# EasyEDA Pro project EasyEDAproject_AngstromIO_Mini_Devboard_2026-03-15.epro, board PCB Panel
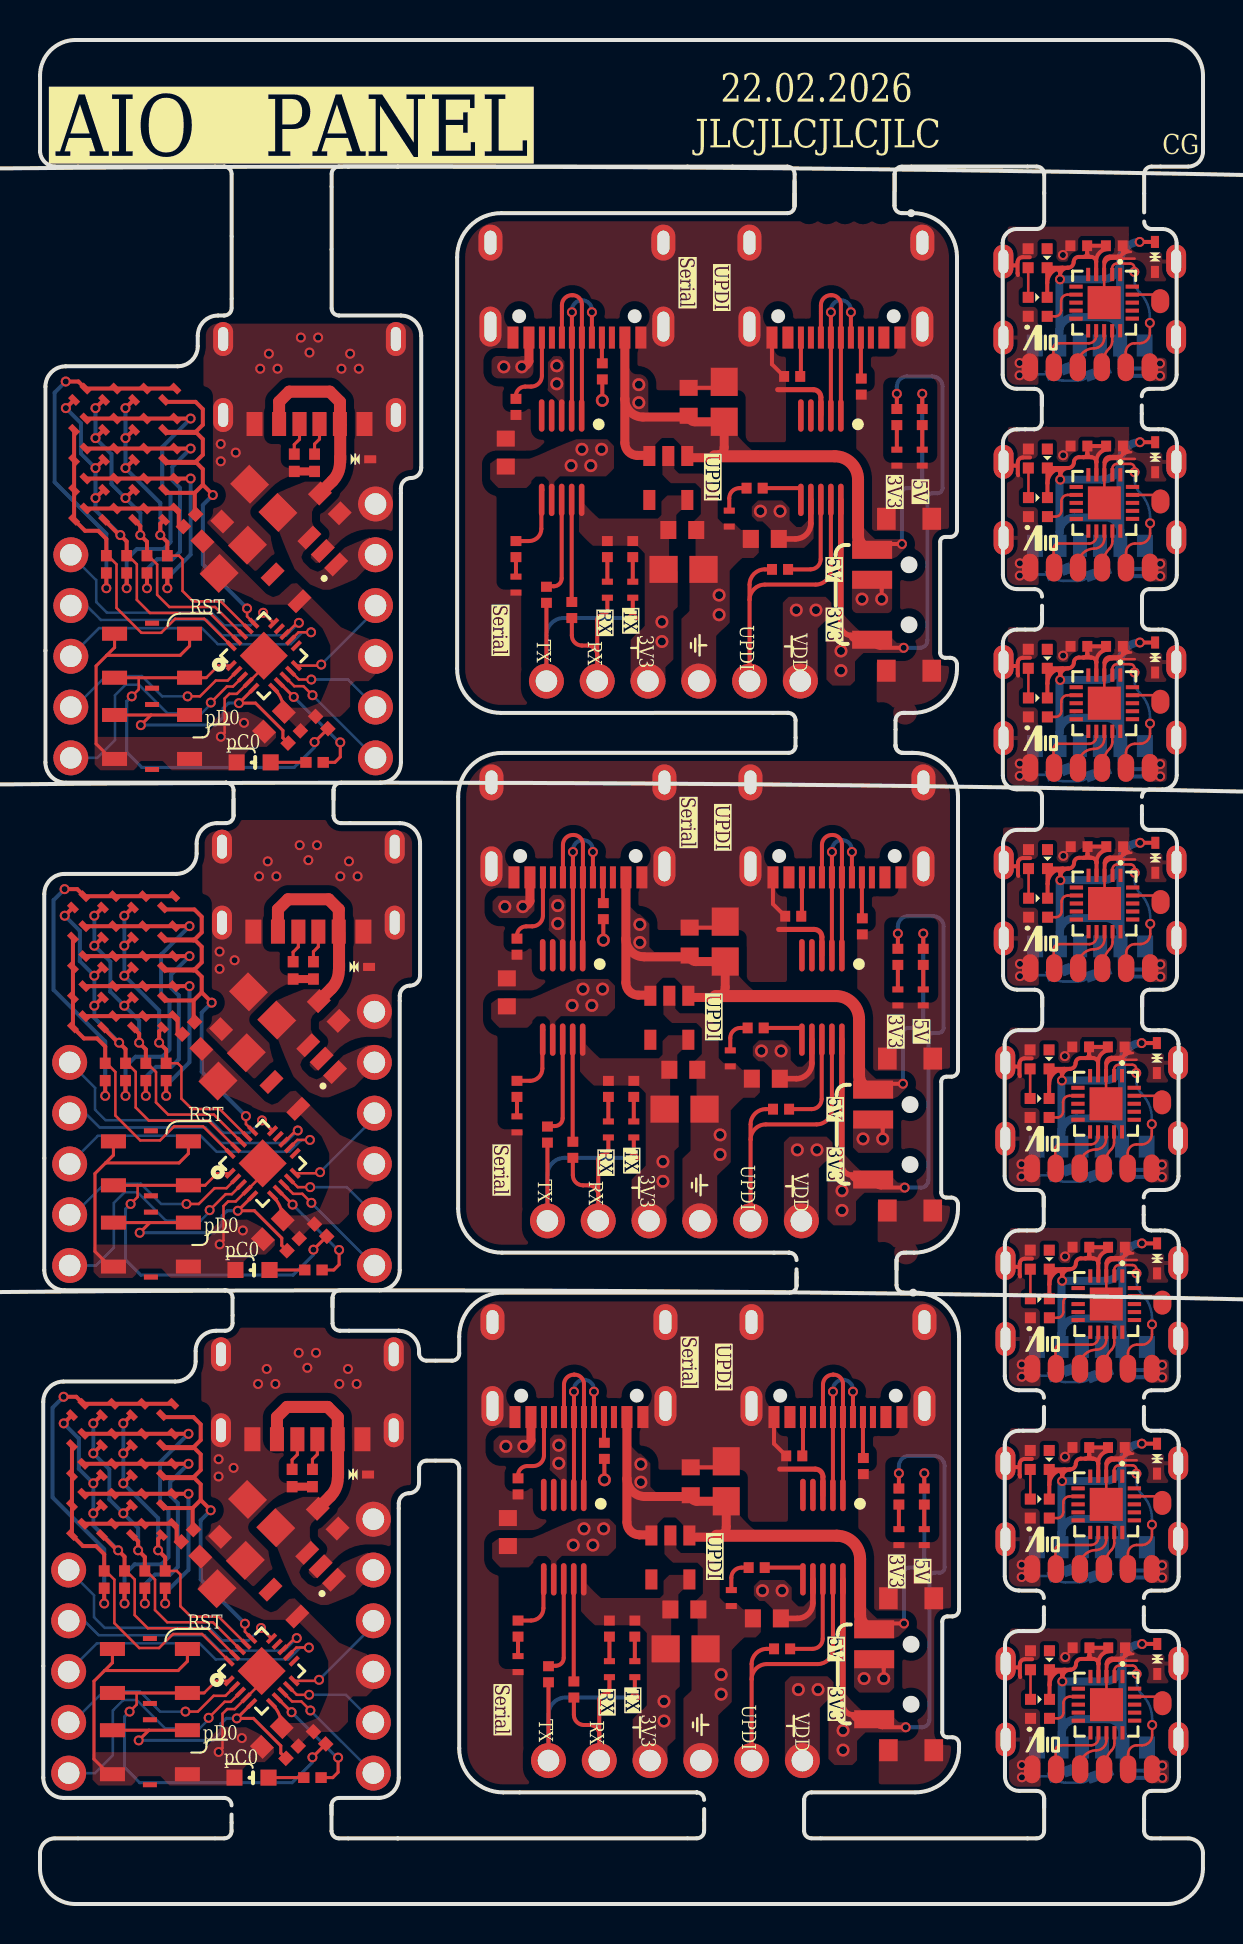
[diagram p1: board, top side]
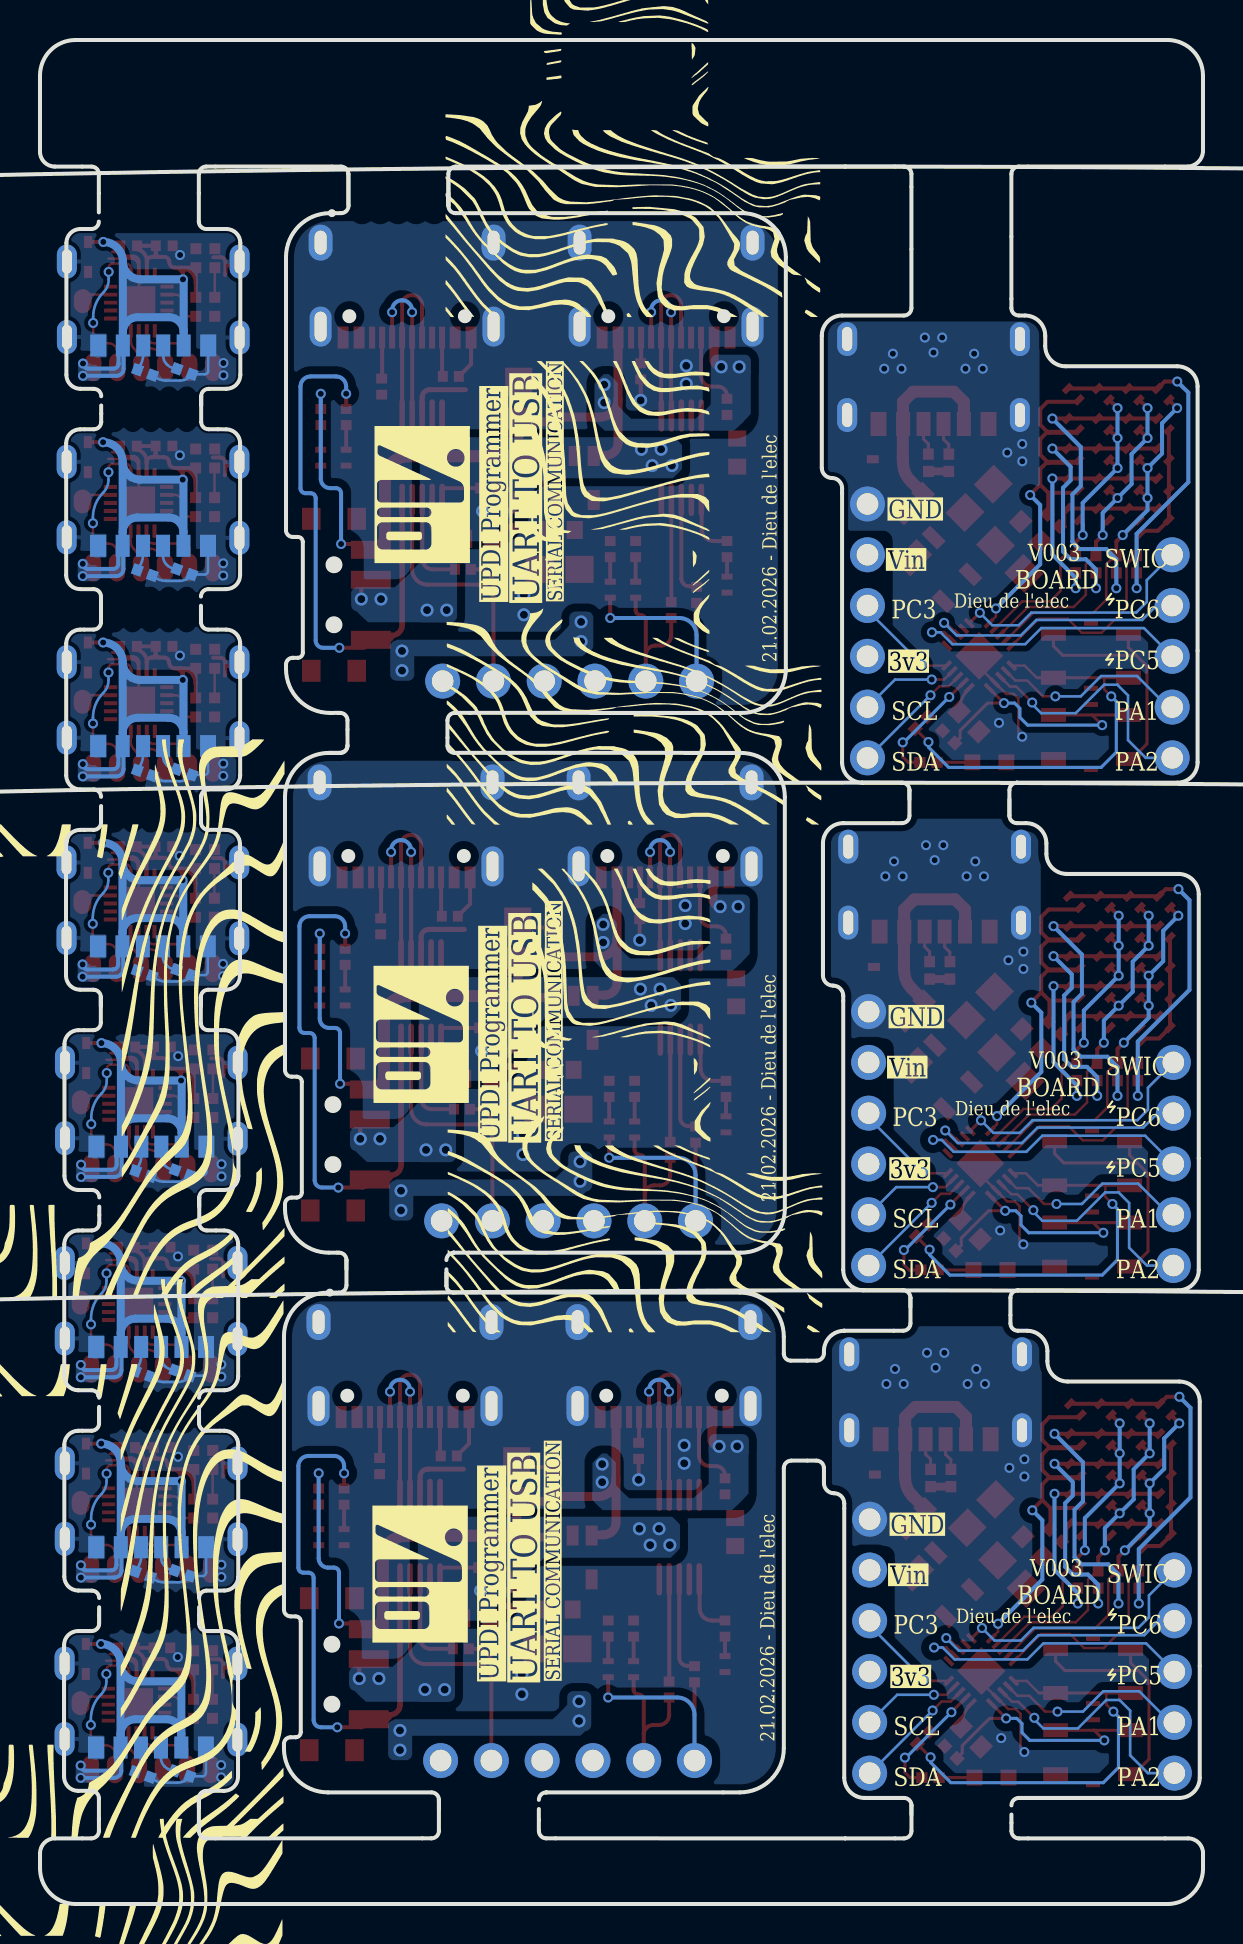
[diagram p2: board, bottom side, seen from below]

Outline 58.17 x 93.24 mm; copper layers: Top Layer, Bottom Layer. Coordinates in mm from the lower left corner of the outline.
Stack: Top Layer 0.035mm / Dielectric1 1.51mm FR4 er 4.5 / Bottom Layer 0.035mm

## Design rules (mm)
template: Custom Config
spacing copperThickness1oz (default): track to track 0.102, other pairs 0.152 to 0.3
spacing copperThickness2oz: track to track 0.203, other pairs 0.152 to 0.3
track width copperThickness1oz (default): min 0.127, default 0.254, max 2.54
track width copperThickness2oz: min 0.203, default 0.254, max 2.54
differential pair differentialPair (default): width min 0.127, default 0.254, max 2.54; gap min 0.152, default 0.152
via viaSize (default): diameter min 0.5, default 0.61, max 10; hole min 0.3, default 0.305, max 6.3
net GND uses PGM gnd
pour e1001 uses copperRegion
pour e456 uses copperRegion1
pour e639 uses copperRegion1
pour e3302 uses copperRegion1
pour e2222 uses cp2
pour e2434 uses copperRegion1
pour e5847 uses copperRegion1
pour e5857 uses copperRegion1
pour e5858 uses copperRegion1
pour e3297 uses copperRegion1
pour e2880 uses copperRegion1
pour e2882 uses copperRegion1
pour e3299 uses copperRegion1
pour e3301 uses copperRegion1
pour e5849 uses copperRegion1
pour e5851 uses copperRegion1
pour e5854 uses copperRegion1
pour e5855 uses copperRegion1

## Placement (name value [footprint] x y rotation side)
C1  100nF  [0603 CAP clean]  11.7 59.14 225 top
C1#2  -  [0603 CAP clean]  11.64 33.75 225 top
C1#3  -  [0603 CAP clean]  11.59 8.35 225 top
C2  10uF  [C0805]  11.19 70.32 135 top
C2#2  -  [C0805]  11.14 44.92 135 top
C2#3  -  [C0805]  11.09 19.53 135 top
C3  100nF  [0603 CAP clean]  14.44 44.67 135 top
C3#2  -  [0603 CAP clean]  14.39 19.28 135 top
C3#3  -  [0603 CAP clean]  14.5 70.06 135 top
C4  100nF  [0603 CAP clean]  8.56 43.27 225 top
C4#2  -  [0603 CAP clean]  8.51 17.88 225 top
C4#3  -  [0603 CAP clean]  8.62 68.66 225 top
C5  10uF  [C0805]  9.61 41.88 45 top
C5#2  -  [C0805]  9.56 16.48 45 top
C5#3  -  [C0805]  9.67 67.27 45 top
C6  10uF  [C0402]  52.06 22.84 0 top
C6#2  -  [C0402]  52.05 42.87 0 top
C6#3  -  [C0402]  52.06 32.85 0 top
C6#4  -  [C0402]  51.95 82.95 0 top
C6#5  -  [C0402]  51.96 62.91 0 top
C6#6  -  [C0402]  51.97 72.93 0 top
C6#7  -  [C0402]  51.97 52.89 0 top
C6#8  -  [C0402]  52.07 12.82 0 top
C7  100nF  [C0402]  53.84 22.84 0 top
C7#2  -  [C0402]  53.83 42.87 0 top
C7#3  -  [C0402]  53.84 32.85 0 top
C7#4  -  [C0402]  53.73 82.95 0 top
C7#5  -  [C0402]  53.74 62.91 0 top
C7#6  -  [C0402]  53.74 72.93 0 top
C7#7  -  [C0402]  53.75 52.89 0 top
C7#8  -  [C0402]  53.85 12.82 0 top
C8  100nF  [0603 CAP clean]  32.23 14.73 180 top
C8#2  -  [0603 CAP clean]  32.13 68.73 180 top
C8#3  -  [0603 CAP clean]  32.18 41.73 180 top
C9  100nF  [0603 CAP clean]  32.55 21.15 270 top
C9#2  -  [0603 CAP clean]  32.44 75.14 270 top
C9#3  -  [0603 CAP clean]  32.49 48.14 270 top
C10  10uF  [C0805]  34.32 21.15 90 top
C10#2  -  [C0805]  34.22 75.14 90 top
C10#3  -  [C0805]  34.27 48.14 90 top
C11  10uF  [C0805]  32.29 12.76 0 top
C11#2  -  [C0805]  32.19 66.76 0 top
C11#3  -  [C0805]  32.24 39.76 0 top
C12  100nF  [0603 CAP clean]  36.36 14.29 0 top
C12#2  -  [0603 CAP clean]  36.25 68.28 0 top
C12#3  -  [0603 CAP clean]  36.3 41.28 0 top
C13  100nF  [0603 CAP clean]  23.4 18.61 270 top
C13#2  -  [0603 CAP clean]  23.3 72.6 270 top
C13#3  -  [0603 CAP clean]  23.35 45.6 270 top
D1  LESD5D5.0CT1G  [SOD-523_L1.2-W0.8-LS1.6-BI]  15.71 46.88 180 top
D1#2  -  [SOD-523_L1.2-W0.8-LS1.6-BI]  15.66 21.48 180 top
D1#3  -  [SOD-523_L1.2-W0.8-LS1.6-BI]  15.77 72.27 180 top
D2  LESD5D5.0CT1G  [SOD-523_L1.2-W0.8-LS1.6-BI]  55.78 52.33 90 top
D2#2  -  [SOD-523_L1.2-W0.8-LS1.6-BI]  55.87 22.28 90 top
D2#3  -  [SOD-523_L1.2-W0.8-LS1.6-BI]  55.86 42.32 90 top
D2#4  -  [SOD-523_L1.2-W0.8-LS1.6-BI]  55.87 32.3 90 top
D2#5  -  [SOD-523_L1.2-W0.8-LS1.6-BI]  55.88 12.26 90 top
D2#6  -  [SOD-523_L1.2-W0.8-LS1.6-BI]  55.76 82.39 90 top
D2#7  -  [SOD-523_L1.2-W0.8-LS1.6-BI]  55.77 62.35 90 top
D2#8  -  [SOD-523_L1.2-W0.8-LS1.6-BI]  55.78 72.37 90 top
LED1  XL-1608UOC-06  [Dice  0603 LED BLANK]  10.63 31.72 0 top
LED1#2  -  [Dice  0603 LED BLANK]  10.58 6.32 0 top
LED1#3  -  [Dice  0603 LED BLANK]  10.69 57.11 0 top
LED2  XL-1005SURC  [LED0402]  1.93 50.13 45 top
LED2#2  -  [LED0402]  1.88 24.74 45 top
LED2#3  -  [LED0402]  1.99 75.52 45 top
LED3  XL-1005SURC  [LED0402]  3.43 50.13 45 top
LED3#2  -  [LED0402]  3.38 24.74 45 top
LED3#3  -  [LED0402]  3.49 75.52 45 top
LED4  XL-1005SURC  [LED0402]  4.93 50.13 45 top
LED4#2  -  [LED0402]  4.88 24.74 45 top
LED4#3  -  [LED0402]  4.99 75.52 45 top
LED5  XL-1005SURC  [LED0402]  6.49 75.52 45 top
LED5#2  -  [LED0402]  6.43 50.13 45 top
LED5#3  -  [LED0402]  6.38 24.74 45 top
LED6  XL-1005SURC  [LED0402]  1.99 74.02 45 top
LED6#2  -  [LED0402]  1.93 48.63 45 top
LED6#3  -  [LED0402]  1.88 23.24 45 top
LED7  XL-1005SURC  [LED0402]  3.43 48.63 45 top
LED7#2  -  [LED0402]  3.49 74.02 45 top
LED7#3  -  [LED0402]  3.38 23.24 45 top
LED8  XL-1005SURC  [LED0402]  4.93 48.63 45 top
LED8#2  -  [LED0402]  4.99 74.02 45 top
LED8#3  -  [LED0402]  4.88 23.24 45 top
LED9  XL-1005SURC  [LED0402]  6.43 48.63 45 top
LED9#2  -  [LED0402]  6.49 74.02 45 top
LED9#3  -  [LED0402]  6.38 23.24 45 top
LED10  XL-1005SURC  [LED0402]  1.93 47.13 45 top
LED10#2  -  [LED0402]  1.99 72.52 45 top
LED10#3  -  [LED0402]  1.88 21.74 45 top
LED11  XL-1005SURC  [LED0402]  3.43 47.13 45 top
LED11#2  -  [LED0402]  3.49 72.52 45 top
LED11#3  -  [LED0402]  3.38 21.74 45 top
LED12  XL-1005SURC  [LED0402]  4.93 47.13 45 top
LED12#2  -  [LED0402]  4.99 72.52 45 top
LED12#3  -  [LED0402]  4.88 21.74 45 top
LED13  XL-1005SURC  [LED0402]  6.43 47.13 45 top
LED13#2  -  [LED0402]  6.49 72.52 45 top
LED13#3  -  [LED0402]  6.38 21.74 45 top
LED14  XL-1005SURC  [LED0402]  1.93 45.63 45 top
LED14#2  -  [LED0402]  1.99 71.02 45 top
LED14#3  -  [LED0402]  1.88 20.24 45 top
LED15  XL-1005SURC  [LED0402]  3.43 45.63 45 top
LED15#2  -  [LED0402]  3.38 20.24 45 top
LED15#3  -  [LED0402]  3.49 71.02 45 top
LED16  XL-1005SURC  [LED0402]  4.93 45.63 45 top
LED16#2  -  [LED0402]  4.88 20.24 45 top
LED16#3  -  [LED0402]  4.99 71.02 45 top
LED17  XL-1005SURC  [LED0402]  6.43 45.63 45 top
LED17#2  -  [LED0402]  6.38 20.24 45 top
LED17#3  -  [LED0402]  6.49 71.02 45 top
LED18  XL-1005SURC  [LED0402]  1.93 44.13 45 top
LED18#2  -  [LED0402]  1.88 18.74 45 top
LED18#3  -  [LED0402]  1.99 69.52 45 top
LED19  XL-1005SURC  [LED0402]  3.43 44.13 45 top
LED19#2  -  [LED0402]  3.38 18.74 45 top
LED19#3  -  [LED0402]  3.49 69.52 45 top
LED20  XL-1005SURC  [LED0402]  4.93 44.13 45 top
LED20#2  -  [LED0402]  4.88 18.74 45 top
LED20#3  -  [LED0402]  4.99 69.52 45 top
LED21  XL-1005SURC  [LED0402]  6.43 44.13 45 top
LED21#2  -  [LED0402]  6.38 18.74 45 top
LED21#3  -  [LED0402]  6.49 69.52 45 top
LED22  SK6805-EC15  [LED-SMD_4P-L1.5-W1.5-BL]  50.01 19.78 90 top
LED22#2  -  [LED-SMD_4P-L1.5-W1.5-BL]  50.01 29.8 90 top
LED22#3  -  [LED-SMD_4P-L1.5-W1.5-BL]  50 39.82 90 top
LED22#4  -  [LED-SMD_4P-L1.5-W1.5-BL]  50.02 9.76 90 top
LED22#5  -  [LED-SMD_4P-L1.5-W1.5-BL]  49.9 79.89 90 top
LED22#6  -  [LED-SMD_4P-L1.5-W1.5-BL]  49.91 59.86 90 top
LED22#7  -  [LED-SMD_4P-L1.5-W1.5-BL]  49.91 69.88 90 top
LED22#8  -  [LED-SMD_4P-L1.5-W1.5-BL]  49.92 49.84 90 top
LED23  SK6805-EC15  [LED-SMD_4P-L1.5-W1.5-BL]  50 22.21 0 top
LED23#2  -  [LED-SMD_4P-L1.5-W1.5-BL]  49.99 42.25 0 top
LED23#3  -  [LED-SMD_4P-L1.5-W1.5-BL]  50 32.23 0 top
LED23#4  -  [LED-SMD_4P-L1.5-W1.5-BL]  50.01 12.19 0 top
LED23#5  -  [LED-SMD_4P-L1.5-W1.5-BL]  49.9 82.33 0 top
LED23#6  -  [LED-SMD_4P-L1.5-W1.5-BL]  49.91 62.29 0 top
LED23#7  -  [LED-SMD_4P-L1.5-W1.5-BL]  49.91 72.31 0 top
LED23#8  -  [LED-SMD_4P-L1.5-W1.5-BL]  49.92 52.27 0 top
LED24  XL-1005SURC  [LED0402]  44.18 45.35 90 top
LED24#2  -  [LED0402]  44.23 18.35 90 top
LED24#3  -  [LED0402]  44.13 72.35 90 top
LED25  XL-1005SURC  [LED0402]  42.91 45.35 90 top
LED25#2  -  [LED0402]  42.96 18.35 90 top
LED25#3  -  [LED0402]  42.86 72.35 90 top
LED26  XL-1005SURC  [LED0402]  34.52 42.3 90 top
LED26#2  -  [LED0402]  34.58 15.3 90 top
LED26#3  -  [LED0402]  34.47 69.3 90 top
LED28  XL-1005SURC  [LED0402]  23.86 39 90 top
LED28#2  -  [LED0402]  23.91 12 90 top
LED28#3  -  [LED0402]  23.81 66 90 top
LED29  XL-1005SURC  [LED0402]  28.43 38.74 90 top
LED29#2  -  [LED0402]  28.48 11.75 90 top
LED29#3  -  [LED0402]  28.38 65.74 90 top
LED30  XL-1005SURC  [LED0402]  29.7 38.74 90 top
LED30#2  -  [LED0402]  29.75 11.75 90 top
LED30#3  -  [LED0402]  29.65 65.74 90 top
NOREF  -  [Pad_e5785]  50.73 46.81 0 top
NOREF#2  -  [Pad_e5810]  50.72 66.85 0 top
NOREF#3  -  [Pad_e5805]  54.31 76.87 0 top
NOREF#4  -  [Pad_e3261]  50.81 26.78 0 top
NOREF#5  -  [Pad_e5809]  50.71 76.87 0 top
NOREF#6  -  [Pad_e2863]  54.41 16.76 0 top
NOREF#7  -  [Pad_e2861]  52.01 16.76 0 top
NOREF#8  -  [Pad_e1895]  1.43 6.55 0 top
NOREF#9  -  [Pad_e5792]  55.52 56.83 0 top
NOREF#10  -  [Pad_e1148]  16.72 44.64 0 top
NOREF#11  -  [Pad_e2260]  38.13 7.18 270 top
NOREF#12  -  [Pad_e5807]  51.91 76.87 0 top
NOREF#13  -  [Pad_e51]  1.54 67.49 0 top
NOREF#14  -  [Pad_e127]  16.78 70.03 0 top
NOREF#15  -  [Pad_e85]  53.22 6.74 0 top
NOREF#16  -  [Pad_e223]  38.08 34.17 270 top
NOREF#17  -  [Pad_e3378]  30.41 61.17 270 top
NOREF#18  -  [Pad_e1136]  1.48 39.56 0 top
NOREF#19  -  [Pad_e221]  33 34.17 270 top
NOREF#20  -  [Pad_e95]  54.42 6.74 0 top
NOREF#21  -  [Pad_e3263]  53.21 26.78 0 top
NOREF#22  -  [Pad_e75]  49.62 6.74 0 top
NOREF#23  -  [Pad_e5797]  51.92 66.85 0 top
NOREF#24  -  [Pad_e3268]  50.8 36.8 0 top
NOREF#25  -  [Pad_e3259]  56.14 30.08 0 top
NOREF#26  -  [Pad_e2862]  53.21 16.76 0 top
NOREF#27  -  [Pad_e5791]  56.05 50.12 0 top
NOREF#28  -  [Pad_e3265]  55.61 26.78 0 top
NOREF#29  -  [Pad_e1893]  1.43 14.17 0 top
NOREF#30  -  [Pad_e1898]  16.67 6.55 0 top
NOREF#31  -  [Pad_e2864]  55.61 16.76 0 top
NOREF#32  -  [Pad_e72]  55.62 6.74 0 top
NOREF#33  -  [Pad_e3379]  32.95 61.17 270 top
NOREF#34  -  [Pad_e90]  16.78 59.87 0 top
NOREF#35  -  [Pad_e2258]  25.43 7.18 270 top
NOREF#36  -  [Pad_e54]  1.54 64.95 0 top
NOREF#37  -  [Pad_e1142]  1.48 34.48 0 top
NOREF#38  -  [Pad_e2262]  33.05 7.18 270 top
NOREF#39  -  [Pad_e2860]  50.81 16.76 0 top
NOREF#40  -  [Pad_e1902]  16.67 16.71 0 top
NOREF#41  -  [Pad_e226]  27.92 34.17 270 top
NOREF#42  -  [Pad_e220]  30.46 34.17 270 top
NOREF#43  -  [Pad_e1137]  1.48 37.02 0 top
NOREF#44  -  [Pad_e102]  16.78 64.95 0 top
NOREF#45  -  [Pad_e5789]  51.93 46.81 0 top
NOREF#46  -  [Pad_e1146]  16.72 39.56 0 top
NOREF#47  -  [Pad_e1135]  1.48 42.1 0 top
NOREF#48  -  [Pad_e222]  35.54 34.17 270 top
NOREF#49  -  [Pad_e1894]  1.43 11.63 0 top
NOREF#50  -  [Pad_e5799]  49.52 66.85 0 top
NOREF#51  -  [Pad_e5806]  54.32 66.85 0 top
NOREF#52  -  [Pad_e2858]  56.13 20.06 0 top
NOREF#53  -  [Pad_e3271]  54.4 36.8 0 top
NOREF#54  -  [Pad_e3270]  53.2 36.8 0 top
NOREF#55  -  [Pad_e1901]  16.67 14.17 0 top
NOREF#56  -  [Pad_e55]  1.54 62.41 0 top
NOREF#57  -  [Pad_e59]  1.54 59.87 0 top
NOREF#58  -  [Pad_e2261]  35.59 7.18 270 top
NOREF#59  -  [Pad_e1138]  1.48 31.94 0 top
NOREF#60  -  [Pad_e1145]  16.72 37.02 0 top
NOREF#61  -  [Pad_e3269]  52 36.8 0 top
NOREF#62  -  [Pad_e5783]  55.53 46.81 0 top
NOREF#63  -  [Pad_e101]  16.78 62.41 0 top
NOREF#64  -  [Pad_e5793]  56.04 60.14 0 top
NOREF#65  -  [Pad_e5787]  53.13 46.81 0 top
NOREF#66  -  [Pad_e2859]  49.61 16.76 0 top
NOREF#67  -  [Pad_e5803]  55.51 76.87 0 top
NOREF#68  -  [Pad_e5796]  49.51 76.87 0 top
NOREF#69  -  [Pad_e5790]  53.11 56.83 0 top
NOREF#70  -  [Pad_e5788]  51.92 56.83 0 top
NOREF#71  -  [Pad_e89]  16.78 57.33 0 top
NOREF#72  -  [Pad_e225]  25.38 34.17 270 top
NOREF#73  -  [Pad_e83]  50.82 6.74 0 top
NOREF#74  -  [Pad_e5794]  54.32 56.83 0 top
NOREF#75  -  [Pad_e5786]  50.71 56.83 0 top
NOREF#76  -  [Pad_e126]  16.78 67.49 0 top
NOREF#77  -  [Pad_e84]  52.02 6.74 0 top
NOREF#78  -  [Pad_e5798]  49.52 56.83 0 top
NOREF#79  -  [Pad_e1903]  16.67 19.25 0 top
NOREF#80  -  [Pad_e3377]  27.87 61.17 270 top
NOREF#81  -  [Pad_e5808]  53.11 76.87 0 top
NOREF#82  -  [Pad_e1899]  16.67 9.09 0 top
NOREF#83  -  [Pad_e5795]  54.33 46.81 0 top
NOREF#84  -  [Pad_e3262]  52.01 26.78 0 top
NOREF#85  -  [Pad_e1144]  16.72 34.48 0 top
NOREF#86  -  [Pad_e2257]  27.97 7.18 270 top
NOREF#87  -  [Pad_e3264]  54.41 26.78 0 top
NOREF#88  -  [Pad_e1143]  16.72 31.94 0 top
NOREF#89  -  [Pad_e5802]  56.03 80.18 0 top
NOREF#90  -  [Pad_e5801]  56.04 70.16 0 top
NOREF#91  -  [Pad_e5784]  49.53 46.81 0 top
NOREF#92  -  [Pad_e1897]  1.43 9.09 0 top
NOREF#93  -  [Pad_e3376]  25.33 61.17 270 top
NOREF#94  -  [Pad_e2259]  30.51 7.18 270 top
NOREF#95  -  [Pad_e56]  1.54 57.33 0 top
NOREF#96  -  [Pad_e3272]  55.6 36.8 0 top
NOREF#97  -  [Pad_e5800]  55.52 66.85 0 top
NOREF#98  -  [Pad_e3380]  35.49 61.17 270 top
NOREF#99  -  [Pad_e1147]  16.72 42.1 0 top
NOREF#100  -  [Pad_e3267]  49.6 36.8 0 top
NOREF#101  -  [Pad_e1900]  16.67 11.63 0 top
NOREF#102  -  [Pad_e3381]  38.03 61.17 270 top
NOREF#103  -  [Pad_e1892]  1.43 16.71 0 top
NOREF#104  -  [Pad_e5804]  53.12 66.85 0 top
NOREF#105  -  [Pad_e3260]  49.61 26.78 0 top
NOREF#106  -  [Pad_e88]  56.14 10.04 0 top
NOREF#107  -  [Pad_e3266]  56.12 40.1 0 top
R1  10K  [R0402]  14.03 33.71 135 top
R1#2  -  [R0402]  13.98 8.31 135 top
R1#3  -  [R0402]  14.09 59.1 135 top
R2  1K  [R0402]  13.68 31.72 0 top
R2#2  -  [R0402]  13.63 6.32 0 top
R2#3  -  [R0402]  13.73 57.11 0 top
R3  100  [R0402]  3.26 41.62 90 top
R3#2  -  [R0402]  3.21 16.23 90 top
R3#3  -  [R0402]  3.32 67.01 90 top
R4  100  [R0402]  4.28 41.62 90 top
R4#2  -  [R0402]  4.23 16.23 90 top
R4#3  -  [R0402]  4.34 67.01 90 top
R5  100  [R0402]  5.29 41.62 90 top
R5#2  -  [R0402]  5.24 16.23 90 top
R5#3  -  [R0402]  5.35 67.01 90 top
R6  100  [R0402]  6.31 41.62 90 top
R6#2  -  [R0402]  6.26 16.23 90 top
R6#3  -  [R0402]  6.37 67.01 90 top
R7  100  [R0402]  7.42 43.82 45 top
R7#2  -  [R0402]  7.37 18.42 45 top
R7#3  -  [R0402]  7.48 69.21 45 top
R8  5.1K  [R0402]  13.68 46.7 90 top
R8#2  -  [R0402]  13.63 21.31 90 top
R8#3  -  [R0402]  13.73 72.09 90 top
R9  5.1K  [R0402]  12.66 46.7 90 top
R9#2  -  [R0402]  12.61 21.31 90 top
R9#3  -  [R0402]  12.72 72.09 90 top
R10  20K  [R0402]  12.66 32.99 225 top
R10#2  -  [R0402]  12.61 7.59 225 top
R10#3  -  [R0402]  12.72 58.38 225 top
R11  5.1K  [thinner 0402]  53.02 16.5 20 bottom
R11#2  -  [thinner 0402]  53.02 26.52 20 bottom
R11#3  -  [thinner 0402]  53.01 36.54 20 bottom
R11#4  -  [thinner 0402]  53.03 6.48 20 bottom
R11#5  -  [thinner 0402]  52.91 76.61 20 bottom
R11#6  -  [thinner 0402]  52.92 56.58 20 bottom
R11#7  -  [thinner 0402]  52.92 66.59 20 bottom
R11#8  -  [thinner 0402]  52.93 46.56 20 bottom
R12  5.1K  [thinner 0402]  51.04 16.55 20 bottom
R12#2  -  [thinner 0402]  51.05 26.56 20 bottom
R12#3  -  [thinner 0402]  51.03 36.58 20 bottom
R12#4  -  [thinner 0402]  51.05 6.53 20 bottom
R12#5  -  [thinner 0402]  50.94 76.66 20 bottom
R12#6  -  [thinner 0402]  50.95 56.62 20 bottom
R12#7  -  [thinner 0402]  50.95 66.64 20 bottom
R12#8  -  [thinner 0402]  50.96 46.6 20 bottom
R13  5.1K  [thinner 0402]  41.13 48.9 90 top
R13#2  -  [thinner 0402]  41.18 21.91 90 top
R13#3  -  [thinner 0402]  41.08 75.9 90 top
R14  5.1K  [thinner 0402]  37.67 49.41 0 top
R14#2  -  [thinner 0402]  37.73 22.42 0 top
R14#3  -  [thinner 0402]  37.62 76.41 0 top
R15  5.1K  [thinner 0402]  28.17 49.67 90 top
R15#2  -  [thinner 0402]  28.23 22.67 90 top
R15#3  -  [thinner 0402]  28.12 76.67 90 top
R16  5.1K  [thinner 0402]  23.86 47.89 90 top
R16#2  -  [thinner 0402]  23.91 20.89 90 top
R16#3  -  [thinner 0402]  23.81 74.89 90 top
R17  5.1K  [thinner 0402]  44.18 47.38 90 top
R17#2  -  [thinner 0402]  44.23 20.38 90 top
R17#3  -  [thinner 0402]  44.13 74.38 90 top
R18  1K  [thinner 0402]  42.91 47.38 90 top
R18#2  -  [thinner 0402]  42.96 20.38 90 top
R18#3  -  [thinner 0402]  42.86 74.38 90 top
R19  1K  [thinner 0402]  35.8 43.82 0 top
R19#2  -  [thinner 0402]  35.85 16.83 0 top
R19#3  -  [thinner 0402]  35.74 70.82 0 top
R20  1K  [thinner 0402]  37.07 39.76 0 top
R20#2  -  [thinner 0402]  37.12 12.76 0 top
R20#3  -  [thinner 0402]  37.01 66.76 0 top
R22  1K  [thinner 0402]  23.86 40.78 90 top
R22#2  -  [thinner 0402]  23.91 13.78 90 top
R22#3  -  [thinner 0402]  23.81 67.78 90 top
R23  1K  [thinner 0402]  25.38 38.49 90 top
R23#2  -  [thinner 0402]  25.43 11.49 90 top
R23#3  -  [thinner 0402]  25.33 65.49 90 top
R24  1K  [thinner 0402]  26.65 37.73 90 top
R24#2  -  [thinner 0402]  26.7 10.73 90 top
R24#3  -  [thinner 0402]  26.6 64.73 90 top
R25  5.1K  [thinner 0402]  28.43 40.78 90 top
R25#2  -  [thinner 0402]  28.48 13.78 90 top
R25#3  -  [thinner 0402]  28.38 67.78 90 top
R26  5.1K  [thinner 0402]  29.7 40.78 90 top
R26#2  -  [thinner 0402]  29.75 13.78 90 top
R26#3  -  [thinner 0402]  29.65 67.78 90 top
SW1  TS-1075S-A1B2-D4  [Btn clean]  5.55 37.05 0 top
SW1#2  -  [Btn clean]  5.5 11.66 0 top
SW1#3  -  [Btn clean]  5.61 62.44 0 top
SW2  TS-1075S-A1B2-D4  [Btn clean]  5.55 32.99 180 top
SW2#2  -  [Btn clean]  5.5 7.59 180 top
SW2#3  -  [Btn clean]  5.61 58.38 180 top
SW3  MK-12C02-G015  [SW-SMD_G-SWITCH_MK-12C02-G015]  43.16 38.49 90 top
SW3#2  -  [SW-SMD_G-SWITCH_MK-12C02-G015]  43.21 11.49 90 top
SW3#3  -  [SW-SMD_G-SWITCH_MK-12C02-G015]  43.11 65.49 90 top
U1  CH32V003F4U6  [QFN-20_L3.0-W3.0-P0.40-TL-EP1.7]  11.14 37.05 45 top
U1#2  -  [QFN-20_L3.0-W3.0-P0.40-TL-EP1.7]  11.09 11.66 45 top
U1#3  -  [QFN-20_L3.0-W3.0-P0.40-TL-EP1.7]  11.19 62.44 45 top
U2  AP2127K-3.3TRG1  [SOT-23-5_L3.0-W1.7-P0.95-LS2.8-BR]  13.17 41.37 45 top
U2#2  -  [SOT-23-5_L3.0-W1.7-P0.95-LS2.8-BR]  13.12 15.97 45 top
U2#3  -  [SOT-23-5_L3.0-W1.7-P0.95-LS2.8-BR]  13.23 66.76 45 top
U3  ATTINY1616-MNR  [QFN-20_L3.0-W3.0-P0.40-BL-EP1.7]  53.33 19.99 180 top
U3#2  -  [QFN-20_L3.0-W3.0-P0.40-BL-EP1.7]  53.32 40.03 180 top
U3#3  -  [QFN-20_L3.0-W3.0-P0.40-BL-EP1.7]  53.33 30.01 180 top
U3#4  -  [QFN-20_L3.0-W3.0-P0.40-BL-EP1.7]  53.34 9.97 180 top
U3#5  -  [QFN-20_L3.0-W3.0-P0.40-BL-EP1.7]  53.22 80.1 180 top
U3#6  -  [QFN-20_L3.0-W3.0-P0.40-BL-EP1.7]  53.23 60.07 180 top
U3#7  -  [QFN-20_L3.0-W3.0-P0.40-BL-EP1.7]  53.24 70.09 180 top
U3#8  -  [QFN-20_L3.0-W3.0-P0.40-BL-EP1.7]  53.24 50.05 180 top
U4  CH340E  [MSOP-10_L3.0-W3.0-P0.50-LS5.0-BL]  39.11 45.35 180 top
U4#2  -  [MSOP-10_L3.0-W3.0-P0.50-LS5.0-BL]  39.16 18.35 180 top
U4#3  -  [MSOP-10_L3.0-W3.0-P0.50-LS5.0-BL]  39.06 72.35 180 top
U6  TLV75733PDBVR  [SOT-23-5_L2.9-W1.6-P0.95-LS2.8-BL]  31.48 44.33 180 top
U6#2  -  [SOT-23-5_L2.9-W1.6-P0.95-LS2.8-BL]  31.53 17.34 180 top
U6#3  -  [SOT-23-5_L2.9-W1.6-P0.95-LS2.8-BL]  31.43 71.33 180 top
U7  CH340E  [MSOP-10_L3.0-W3.0-P0.50-LS5.0-BL]  26.14 45.35 180 top
U7#2  -  [MSOP-10_L3.0-W3.0-P0.50-LS5.0-BL]  26.2 18.35 180 top
U7#3  -  [MSOP-10_L3.0-W3.0-P0.50-LS5.0-BL]  26.09 72.35 180 top
USB  TYPE-C 6P(073)  [USB C one pad removed]  52.61 19.92 0 bottom
USB1  TYPE-C 6P(073)  [TYPE-C-SMD_TYPE-C-6P-073]  13.42 50.77 180 top
USB1#2  -  [TYPE-C-SMD_TYPE-C-6P-073]  13.37 25.37 180 top
USB1#3  -  [TYPE-C-SMD_TYPE-C-6P-073]  13.48 76.16 180 top
USB2  TYPE-C 16PIN 2MD(073)  [USB-C-SMD_TYPE-C-6PIN-2MD-073]  39.86 53.73 180 top
USB2#2  -  [USB-C-SMD_TYPE-C-6PIN-2MD-073]  39.91 26.73 180 top
USB2#3  -  [USB-C-SMD_TYPE-C-6PIN-2MD-073]  39.81 80.73 180 top
USB3  TYPE-C 16PIN 2MD(073)  [USB-C-SMD_TYPE-C-6PIN-2MD-073]  26.91 53.73 180 top
USB3#2  -  [USB-C-SMD_TYPE-C-6PIN-2MD-073]  26.96 26.73 180 top
USB3#3  -  [USB-C-SMD_TYPE-C-6PIN-2MD-073]  26.85 80.73 180 top
USB#2  -  [USB C one pad removed]  52.61 29.94 0 bottom
USB#3  -  [USB C one pad removed]  52.6 39.96 0 bottom
USB#4  -  [USB C one pad removed]  52.5 80.03 0 bottom
USB#5  -  [USB C one pad removed]  52.51 60 0 bottom
USB#6  -  [USB C one pad removed]  52.52 70.02 0 bottom
USB#7  -  [USB C one pad removed]  52.52 49.98 0 bottom
USB#8  -  [USB C one pad removed]  52.62 9.9 0 bottom

## Footprints (pads in the part's own frame, mm; a bottom-side part is the same pattern mirrored in y, then rotated)
0603 CAP clean
  rect 0.8x0.9 smd: 1(-0.7,0) 2(0.7,0)
Btn clean
  rect 1.25x0.7 smd: 1(-1.875,1.1) 2(1.875,1.1) 3(-1.875,-1.1) 4(1.875,-1.1)
  rect 0.7x0.25 smd: 5(0,-1.625) 6(0,1.625)
C0402
  rect 0.5x0.54 smd: 1(-0.42,0) 2(0.42,0)
C0805
  rect 1.41x1.35 smd: 1(-1,0) 2(1,0)
Dice  0603 LED BLANK
  rect 0.8x0.8 smd: 1(0.851,0) 2(-0.851,0)
LED0402
  rect 0.3x0.55 smd: 1(-0.4,0) 2(0.4,0)
LED-SMD_4P-L1.5-W1.5-BL
  rect 0.55x0.55 smd: 1(-0.475,-0.475) 2(0.475,-0.475) 3(0.475,0.475) 4(-0.475,0.475)
MSOP-10_L3.0-W3.0-P0.50-LS5.0-BL
  oval 0.28x1.62 smd: 1(-1,-2.11) 2(-0.5,-2.11) 3(0,-2.11) 4(0.5,-2.11) 5(1,-2.11) 6(1,2.11) 7(0.5,2.11) 8(0,2.11) 9(-0.5,2.11) 10(-1,2.11)
Pad_e51
  rrect 1.75x1.75 hole 1.08: 1(0,0)
Pad_e54
  rrect 1.75x1.75 hole 1.08: 2(0,0)
Pad_e55
  rrect 1.75x1.75 hole 1.08: 3(0,0)
Pad_e56
  rrect 1.75x1.75 hole 1.08: 4(0,0)
Pad_e59
  rrect 1.75x1.75 hole 1.08: 5(0,0)
Pad_e72
  rrect 0.82x1.4 smd: 1(0,0)
Pad_e75
  rrect 0.82x1.4 smd: 1(0,0)
Pad_e83
  rrect 0.82x1.4 smd: 1(0,0)
Pad_e84
  rrect 0.82x1.4 smd: 1(0,0)
Pad_e85
  rrect 0.82x1.4 smd: 1(0,0)
Pad_e88
  rrect 0.9x1.2 smd: 1(0,0)
Pad_e89
  rrect 1.75x1.75 hole 1.08: 4(0,0)
Pad_e90
  rrect 1.75x1.75 hole 1.08: 5(0,0)
Pad_e95
  rrect 0.82x1.4 smd: 1(0,0)
Pad_e101
  rrect 1.75x1.75 hole 1.08: 3(0,0)
Pad_e102
  rrect 1.75x1.75 hole 1.08: 2(0,0)
Pad_e126
  rrect 1.75x1.75 hole 1.08: 2(0,0)
Pad_e127
  rrect 1.75x1.75 hole 1.08: 1(0,0)
Pad_e220
  rrect 1.75x1.75 hole 1.08: 5(0,0)
Pad_e221
  rrect 1.75x1.75 hole 1.08: 3(0,0)
Pad_e222
  rrect 1.75x1.75 hole 1.08: 2(0,0)
Pad_e223
  rrect 1.75x1.75 hole 1.08: 2(0,0)
Pad_e225
  rrect 1.75x1.75 hole 1.08: 4(0,0)
Pad_e226
  rrect 1.75x1.75 hole 1.08: 5(0,0)
Pad_e1135
  rrect 1.75x1.75 hole 1.08: 1(0,0)
Pad_e1136
  rrect 1.75x1.75 hole 1.08: 2(0,0)
Pad_e1137
  rrect 1.75x1.75 hole 1.08: 3(0,0)
Pad_e1138
  rrect 1.75x1.75 hole 1.08: 4(0,0)
Pad_e1142
  rrect 1.75x1.75 hole 1.08: 5(0,0)
Pad_e1143
  rrect 1.75x1.75 hole 1.08: 4(0,0)
Pad_e1144
  rrect 1.75x1.75 hole 1.08: 5(0,0)
Pad_e1145
  rrect 1.75x1.75 hole 1.08: 3(0,0)
Pad_e1146
  rrect 1.75x1.75 hole 1.08: 2(0,0)
Pad_e1147
  rrect 1.75x1.75 hole 1.08: 2(0,0)
Pad_e1148
  rrect 1.75x1.75 hole 1.08: 1(0,0)
Pad_e1892
  rrect 1.75x1.75 hole 1.08: 1(0,0)
Pad_e1893
  rrect 1.75x1.75 hole 1.08: 2(0,0)
Pad_e1894
  rrect 1.75x1.75 hole 1.08: 3(0,0)
Pad_e1895
  rrect 1.75x1.75 hole 1.08: 4(0,0)
Pad_e1897
  rrect 1.75x1.75 hole 1.08: 5(0,0)
Pad_e1898
  rrect 1.75x1.75 hole 1.08: 4(0,0)
Pad_e1899
  rrect 1.75x1.75 hole 1.08: 5(0,0)
Pad_e1900
  rrect 1.75x1.75 hole 1.08: 3(0,0)
Pad_e1901
  rrect 1.75x1.75 hole 1.08: 2(0,0)
Pad_e1902
  rrect 1.75x1.75 hole 1.08: 2(0,0)
Pad_e1903
  rrect 1.75x1.75 hole 1.08: 1(0,0)
Pad_e2257
  rrect 1.75x1.75 hole 1.08: 5(0,0)
Pad_e2258
  rrect 1.75x1.75 hole 1.08: 4(0,0)
Pad_e2259
  rrect 1.75x1.75 hole 1.08: 5(0,0)
Pad_e2260
  rrect 1.75x1.75 hole 1.08: 2(0,0)
Pad_e2261
  rrect 1.75x1.75 hole 1.08: 2(0,0)
Pad_e2262
  rrect 1.75x1.75 hole 1.08: 3(0,0)
Pad_e2858
  rrect 0.9x1.2 smd: 1(0,0)
Pad_e2859
  rrect 0.82x1.4 smd: 1(0,0)
Pad_e2860
  rrect 0.82x1.4 smd: 1(0,0)
Pad_e2861
  rrect 0.82x1.4 smd: 1(0,0)
Pad_e2862
  rrect 0.82x1.4 smd: 1(0,0)
Pad_e2863
  rrect 0.82x1.4 smd: 1(0,0)
Pad_e2864
  rrect 0.82x1.4 smd: 1(0,0)
Pad_e3259
  rrect 0.9x1.2 smd: 1(0,0)
Pad_e3260
  rrect 0.82x1.4 smd: 1(0,0)
Pad_e3261
  rrect 0.82x1.4 smd: 1(0,0)
Pad_e3262
  rrect 0.82x1.4 smd: 1(0,0)
Pad_e3263
  rrect 0.82x1.4 smd: 1(0,0)
Pad_e3264
  rrect 0.82x1.4 smd: 1(0,0)
Pad_e3265
  rrect 0.82x1.4 smd: 1(0,0)
Pad_e3266
  rrect 0.9x1.2 smd: 1(0,0)
Pad_e3267
  rrect 0.82x1.4 smd: 1(0,0)
Pad_e3268
  rrect 0.82x1.4 smd: 1(0,0)
Pad_e3269
  rrect 0.82x1.4 smd: 1(0,0)
Pad_e3270
  rrect 0.82x1.4 smd: 1(0,0)
Pad_e3271
  rrect 0.82x1.4 smd: 1(0,0)
Pad_e3272
  rrect 0.82x1.4 smd: 1(0,0)
Pad_e3376
  rrect 1.75x1.75 hole 1.08: 4(0,0)
Pad_e3377
  rrect 1.75x1.75 hole 1.08: 5(0,0)
Pad_e3378
  rrect 1.75x1.75 hole 1.08: 5(0,0)
Pad_e3379
  rrect 1.75x1.75 hole 1.08: 3(0,0)
Pad_e3380
  rrect 1.75x1.75 hole 1.08: 2(0,0)
Pad_e3381
  rrect 1.75x1.75 hole 1.08: 2(0,0)
Pad_e5783
  rrect 0.82x1.4 smd: 1(0,0)
Pad_e5784
  rrect 0.82x1.4 smd: 1(0,0)
Pad_e5785
  rrect 0.82x1.4 smd: 1(0,0)
Pad_e5786
  rrect 0.82x1.4 smd: 1(0,0)
Pad_e5787
  rrect 0.82x1.4 smd: 1(0,0)
Pad_e5788
  rrect 0.82x1.4 smd: 1(0,0)
Pad_e5789
  rrect 0.82x1.4 smd: 1(0,0)
Pad_e5790
  rrect 0.82x1.4 smd: 1(0,0)
Pad_e5791
  rrect 0.9x1.2 smd: 1(0,0)
Pad_e5792
  rrect 0.82x1.4 smd: 1(0,0)
Pad_e5793
  rrect 0.9x1.2 smd: 1(0,0)
Pad_e5794
  rrect 0.82x1.4 smd: 1(0,0)
Pad_e5795
  rrect 0.82x1.4 smd: 1(0,0)
Pad_e5796
  rrect 0.82x1.4 smd: 1(0,0)
Pad_e5797
  rrect 0.82x1.4 smd: 1(0,0)
Pad_e5798
  rrect 0.82x1.4 smd: 1(0,0)
Pad_e5799
  rrect 0.82x1.4 smd: 1(0,0)
Pad_e5800
  rrect 0.82x1.4 smd: 1(0,0)
Pad_e5801
  rrect 0.9x1.2 smd: 1(0,0)
Pad_e5802
  rrect 0.9x1.2 smd: 1(0,0)
Pad_e5803
  rrect 0.82x1.4 smd: 1(0,0)
Pad_e5804
  rrect 0.82x1.4 smd: 1(0,0)
Pad_e5805
  rrect 0.82x1.4 smd: 1(0,0)
Pad_e5806
  rrect 0.82x1.4 smd: 1(0,0)
Pad_e5807
  rrect 0.82x1.4 smd: 1(0,0)
Pad_e5808
  rrect 0.82x1.4 smd: 1(0,0)
Pad_e5809
  rrect 0.82x1.4 smd: 1(0,0)
Pad_e5810
  rrect 0.82x1.4 smd: 1(0,0)
QFN-20_L3.0-W3.0-P0.40-BL-EP1.7
  rect 0.2x0.665 smd: 1(-0.8,-1.407) 2(-0.4,-1.407) 3(0,-1.407) 4(0.4,-1.407) 5(0.8,-1.407) 11(0.8,1.407) 12(0.4,1.407) 13(0,1.407) 14(-0.4,1.407) 15(-0.8,1.407)
  rect 0.665x0.2 smd: 6(1.407,-0.8) 7(1.407,-0.4) 8(1.407,0) 9(1.407,0.4) 10(1.407,0.8) 16(-1.407,0.8) 17(-1.407,0.4) 18(-1.407,0) 19(-1.407,-0.4) 20(-1.407,-0.8)
  rect 1.65x1.65 smd: 21(0,0)
QFN-20_L3.0-W3.0-P0.40-TL-EP1.7
  rect 0.6x0.2 smd: 1(-1.5,0.8) 2(-1.5,0.401) 3(-1.5,0) 4(-1.5,-0.4) 5(-1.5,-0.8) 11(1.5,-0.8) 12(1.5,-0.4) 13(1.5,0) 14(1.5,0.401) 15(1.5,0.8)
  rect 0.2x0.6 smd: 6(-0.8,-1.5) 7(-0.4,-1.5) 8(0,-1.5) 9(0.4,-1.5) 10(0.799,-1.5) 16(0.8,1.5) 17(0.4,1.5) 18(0,1.5) 19(-0.4,1.5) 20(-0.8,1.5)
  rect 1.7x1.7 smd: 21(0,0)
R0402
  rect 0.566x0.54 smd: 1(-0.433,0) 2(0.433,0)
SOD-523_L1.2-W0.8-LS1.6-BI
  rect 0.6x0.4 smd: 1(-0.75,0) 2(0.75,0)
SOT-23-5_L2.9-W1.6-P0.95-LS2.8-BL
  rect 0.6x1 smd: 1(-0.95,-1.1) 2(0,-1.1) 3(0.95,-1.1) 4(0.95,1.1) 5(-0.95,1.1)
SOT-23-5_L3.0-W1.7-P0.95-LS2.8-BR
  rect 1.1x0.6 smd: 1(1.3,-0.95) 2(1.3,0) 3(1.3,0.95) 4(-1.3,0.95) 5(-1.3,-0.95)
SW-SMD_G-SWITCH_MK-12C02-G015
  rect 0.9x2 smd: 1(-2.25,1.49) 2(0.75,1.49) 3(2.25,1.49)
  rect 1.1x0.93 smd: 4(3.8,0.779) 5(3.8,-1.49) 6(-3.8,-1.49) 7(-3.8,0.779)
thinner 0402
  rect 0.5x0.54 smd: 1(-0.403,0) 2(0.402,0)
TYPE-C-SMD_TYPE-C-6P-073
  oval 1x1.7 hole 0.5x1.2: 7(-4.32,1.675) 7(-4.32,-2.125) 7(4.32,1.675) 7(4.32,-2.125)
  rect 0.7x1.2 smd: A5(-0.5,2.125) A9(1.52,2.125) B5(0.5,2.125) B9(-1.52,2.125)
  rect 0.8x1.2 smd: A12(2.75,2.125) B12(-2.75,2.125)
USB C one pad removed
  oval 1x1.7 hole 0.5x1.2: 7(-4.32,-2.125) 7(-4.32,1.675) 7(4.318,1.651) 7(4.32,-2.125)
  rect 0.7x1.1 smd: A5(-0.5,2.075) A9(1.52,2.075) B5(0.5,2.075) B9(-1.52,2.075)
  rect 0.8x1.1 smd: A12(2.75,2.075) B12(-2.75,2.075)
USB-C-SMD_TYPE-C-6PIN-2MD-073
  rect 0.55x1.1 smd: 1(-3.2,2.375) 2(-2.4,2.375) 11(2.4,2.375) 12(3.2,2.375)
  rect 0.3x1.1 smd: 3(-1.75,2.375) 4(-1.25,2.375) 5(-0.75,2.375) 6(-0.25,2.375) 7(0.25,2.375) 8(0.75,2.375) 9(1.25,2.375) 10(1.75,2.375)
  oval 1.1x2 hole 0.6x1.5: 13(-4.325,1.825) 14(4.325,1.825)
  oval 1.2x1.8 hole 0.6x1.2: 13(-4.325,-2.375) 14(4.325,-2.375)

## Nets
+3.3V: C1.1 C1#2.1 C1#3.1 C4.2 C4#2.2 C4#3.2 C5.1 C5#2.1 C5#3.1 C8.2 C8#2.2 C8#3.2 C11.1 C11#2.1 C11#3.1 NOREF#17.5 NOREF#42.5 NOREF#60.3 NOREF#63.3 NOREF#94.5 NOREF#101.3 R1.2 R1#2.2 R1#3.2 R10.1 R10#2.1 R10#3.1 R18.2 R18#2.2 R18#3.2 R25.2 R25#2.2 R25#3.2 R26.2 R26#2.2 R26#3.2 SW3.1 SW3#2.1 SW3#3.1 U1.6 U1#2.6 U1#3.6 U2.5 U2#2.5 U2#3.5 U4.10 U4#2.10 U4#3.10 U6.5 U6#2.5 U6#3.5 U7.10 U7#2.10 U7#3.10
+5V: C6.2 C6#2.2 C6#3.2 C6#4.2 C6#5.2 C6#6.2 C6#7.2 C6#8.2 C7.1 C7#2.1 C7#3.1 C7#4.1 C7#5.1 C7#6.1 C7#7.1 C7#8.1 D2.2 D2#2.2 D2#3.2 D2#4.2 D2#5.2 D2#6.2 D2#7.2 D2#8.2 LED22.2 LED22#2.2 LED22#3.2 LED22#4.2 LED22#5.2 LED22#6.2 LED22#7.2 LED22#8.2 LED23.2 LED23#2.2 LED23#3.2 LED23#4.2 LED23#5.2 LED23#6.2 LED23#7.2 LED23#8.2 NOREF#9.1 NOREF#28.1 NOREF#31.1 NOREF#32.1 NOREF#62.1 NOREF#67.1 NOREF#96.1 NOREF#97.1 U3.4 U3#2.4 U3#3.4 U3#4.4 U3#5.4 U3#6.4 U3#7.4 U3#8.4 USB.A9 USB.B9 USB#2.A9 USB#2.B9 USB#3.A9 USB#3.B9 USB#4.A9 USB#4.B9 USB#5.A9 USB#5.B9 USB#6.A9 USB#6.B9 USB#7.A9 USB#7.B9 USB#8.A9 USB#8.B9
GND: C1.2 C1#2.2 C1#3.2 C2.2 C2#2.2 C2#3.2 C3.1 C3#2.1 C3#3.1 C4.1 C4#2.1 C4#3.1 C5.2 C5#2.2 C5#3.2 C6.1 C6#2.1 C6#3.1 C6#4.1 C6#5.1 C6#6.1 C6#7.1 C6#8.1 C7.2 C7#2.2 C7#3.2 C7#4.2 C7#5.2 C7#6.2 C7#7.2 C7#8.2 C8.1 C8#2.1 C8#3.1 C9.1 C9#2.1 C9#3.1 C10.2 C10#2.2 C10#3.2 C11.2 C11#2.2 C11#3.2 C12.1 C12#2.1 C12#3.1 C13.1 C13#2.1 C13#3.1 D1.1 D1#2.1 D1#3.1 D2.1 D2#2.1 D2#3.1 D2#4.1 D2#5.1 D2#6.1 D2#7.1 D2#8.1 LED1.2 LED1#2.2 LED1#3.2 LED22.4 LED22#2.4 LED22#3.4 LED22#4.4 LED22#5.4 LED22#6.4 LED22#7.4 LED22#8.4 LED23.4 LED23#2.4 LED23#3.4 LED23#4.4 LED23#5.4 LED23#6.4 LED23#7.4 LED23#8.4 LED24.1 LED24#2.1 LED24#3.1 LED25.1 LED25#2.1 LED25#3.1 LED26.1 LED26#2.1 LED26#3.1 LED28.1 LED28#2.1 LED28#3.1 NOREF#10.1 NOREF#14.1 NOREF#19.3 NOREF#22.1 NOREF#33.3 NOREF#38.3 NOREF#50.1 NOREF#66.1 NOREF#68.1 NOREF#78.1 NOREF#79.1 NOREF#91.1 NOREF#100.1 NOREF#105.1 R8.1 R8#2.1 R8#3.1 R9.1 R9#2.1 R9#3.1 R11.1 R11#2.1 R11#3.1 R11#4.1 R11#5.1 R11#6.1 R11#7.1 R11#8.1 R12.1 R12#2.1 R12#3.1 R12#4.1 R12#5.1 R12#6.1 R12#7.1 R12#8.1 R13.1 R13#2.1 R13#3.1 R14.1 R14#2.1 R14#3.1 R15.1 R15#2.1 R15#3.1 R16.1 R16#2.1 R16#3.1 SW1.1 SW1.2 SW1#2.1 SW1#2.2 SW1#3.1 SW1#3.2 SW2.1 SW2.2 SW2#2.1 SW2#2.2 SW2#3.1 SW2#3.2 SW3.4 SW3.5 SW3.6 SW3.7 SW3#2.4 SW3#2.5 SW3#2.6 SW3#2.7 SW3#3.4 SW3#3.5 SW3#3.6 SW3#3.7 U1.4 U1.21 U1#2.4 U1#2.21 U1#3.4 U1#3.21 U2.2 U2#2.2 U2#3.2 U3.3 U3.21 U3#2.3 U3#2.21 U3#3.3 U3#3.21 U3#4.3 U3#4.21 U3#5.3 U3#5.21 U3#6.3 U3#6.21 U3#7.3 U3#7.21 U3#8.3 U3#8.21 U4.3 U4#2.3 U4#3.3 U6.2 U6#2.2 U6#3.2 U7.3 U7#2.3 U7#3.3 USB.7 USB.A12 USB.B12 USB1.7 USB1.A12 USB1.B12 USB1#2.7 USB1#2.A12 USB1#2.B12 USB1#3.7 USB1#3.A12 USB1#3.B12 USB2.1 USB2.12 USB2.13 USB2.14 USB2#2.1 USB2#2.12 USB2#2.13 USB2#2.14 USB2#3.1 USB2#3.12 USB2#3.13 USB2#3.14 USB3.1 USB3.12 USB3.13 USB3.14 USB3#2.1 USB3#2.12 USB3#2.13 USB3#2.14 USB3#3.1 USB3#3.12 USB3#3.13 USB3#3.14 USB#2.7 USB#2.A12 USB#2.B12 USB#3.7 USB#3.A12 USB#3.B12 USB#4.7 USB#4.A12 USB#4.B12 USB#5.7 USB#5.A12 USB#5.B12 USB#6.7 USB#6.A12 USB#6.B12 USB#7.7 USB#7.A12 USB#7.B12 USB#8.7 USB#8.A12 USB#8.B12
VBUS: C9.2 C9#2.2 C9#3.2 C10.1 C10#2.1 C10#3.1 R17.2 R17#2.2 R17#3.2 SW3.3 SW3#2.3 SW3#3.3 U6.1 U6.3 U6#2.1 U6#2.3 U6#3.1 U6#3.3 USB3.2 USB3.11 USB3#2.2 USB3#2.11 USB3#3.2 USB3#3.11
VDD.P: C12.2 C12#2.2 C12#3.2 C13.2 C13#2.2 C13#3.2 NOREF#11.2 NOREF#16.2 NOREF#102.2 SW3.2 SW3#2.2 SW3#3.2 U4.7 U4#2.7 U4#3.7 U7.7 U7#2.7 U7#3.7
VIN: C2.1 C2#2.1 C2#3.1 C3.2 C3#2.2 C3#3.2 D1.2 D1#2.2 D1#3.2 NOREF#40.2 NOREF#76.2 NOREF#99.2 U2.1 U2.3 U2#2.1 U2#2.3 U2#3.1 U2#3.3 USB1.A9 USB1.B9 USB1#2.A9 USB1#2.B9 USB1#3.A9 USB1#3.B9
D: LED22.1 LED22#2.1 LED22#3.1 LED22#4.1 LED22#5.1 LED22#6.1 LED22#7.1 LED22#8.1 U3.7 U3#2.7 U3#3.7 U3#4.7 U3#5.7 U3#6.7 U3#7.7 U3#8.7
D+.PGM: U4.1 U4#2.1 U4#3.1 USB2.6 USB2.8 USB2#2.6 USB2#2.8 USB2#3.6 USB2#3.8
D+.SERIAL: U7.1 U7#2.1 U7#3.1 USB3.6 USB3.8 USB3#2.6 USB3#2.8 USB3#3.6 USB3#3.8
D-.PGM: U4.2 U4#2.2 U4#3.2 USB2.5 USB2.7 USB2#2.5 USB2#2.7 USB2#3.5 USB2#3.7
D-.SERIAL: U7.2 U7#2.2 U7#3.2 USB3.5 USB3.7 USB3#2.5 USB3#2.7 USB3#3.5 USB3#3.7
L1: LED6.1 LED6#2.1 LED6#3.1 LED10.1 LED10#2.1 LED10#3.1 LED14.1 LED14#2.1 LED14#3.1 LED18.1 LED18#2.1 LED18#3.1 R3.2 R3#2.2 R3#3.2 U1.20 U1#2.20 U1#3.20
L2: LED2.1 LED2#2.1 LED2#3.1 LED11.1 LED11#2.1 LED11#3.1 LED15.1 LED15#2.1 LED15#3.1 LED19.1 LED19#2.1 LED19#3.1 R4.2 R4#2.2 R4#3.2 U1.19 U1#2.19 U1#3.19
L3: LED3.1 LED3#2.1 LED3#3.1 LED7.1 LED7#2.1 LED7#3.1 LED16.1 LED16#2.1 LED16#3.1 LED20.1 LED20#2.1 LED20#3.1 R5.2 R5#2.2 R5#3.2 U1.18 U1#2.18 U1#3.18
L4: LED4.1 LED4#2.1 LED4#3.1 LED8.1 LED8#2.1 LED8#3.1 LED12.1 LED12#2.1 LED12#3.1 LED21.1 LED21#2.1 LED21#3.1 R6.2 R6#2.2 R6#3.2 U1.17 U1#2.17 U1#3.17
L5: LED5.1 LED5#2.1 LED5#3.1 LED9.1 LED9#2.1 LED9#3.1 LED13.1 LED13#2.1 LED13#3.1 LED17.1 LED17#2.1 LED17#3.1 R7.2 R7#2.2 R7#3.2 U1.16 U1#2.16 U1#3.16
PA1: NOREF#37.5 NOREF#57.5 NOREF#92.5 U1.2 U1#2.2 U1#3.2
PA2: NOREF#8.4 NOREF#59.4 NOREF#95.4 U1.3 U1#2.3 U1#3.3
PA3: NOREF#3.1 NOREF#6.1 NOREF#20.1 NOREF#51.1 NOREF#53.1 NOREF#74.1 NOREF#83.1 NOREF#87.1 U3.2 U3#2.2 U3#3.2 U3#4.2 U3#5.2 U3#6.2 U3#7.2 U3#8.2
PB2: NOREF.1 NOREF#2.1 NOREF#4.1 NOREF#5.1 NOREF#24.1 NOREF#39.1 NOREF#73.1 NOREF#75.1 U3.12 U3#2.12 U3#3.12 U3#4.12 U3#5.12 U3#6.12 U3#7.12 U3#8.12
PC0: R2.2 R2#2.2 R2#3.2 U1.7 U1#2.7 U1#3.7
PC3: NOREF#44.2 NOREF#46.2 NOREF#55.2 U1.10 U1#2.10 U1#3.10
PC4: U1.11 U1#2.11 U1#3.11
PC5.FT: NOREF#43.3 NOREF#49.3 NOREF#56.3 U1.12 U1#2.12 U1#3.12
PC6.FT: NOREF#18.2 NOREF#29.2 NOREF#36.2 U1.13 U1#2.13 U1#3.13
PC7: U1.14 U1#2.14 U1#3.14
PD0: R10.2 R10#2.2 R10#3.2 SW2.3 SW2.4 SW2#2.3 SW2#2.4 SW2#3.3 SW2#3.4 U1.5 U1#2.5 U1#3.5
RX: LED29.1 LED29#2.1 LED29#3.1 NOREF#41.5 NOREF#80.5 NOREF#86.5 R24.1 R24#2.1 R24#3.1
SCL: NOREF#15.1 NOREF#21.1 NOREF#26.1 NOREF#34.5 NOREF#54.1 NOREF#65.1 NOREF#69.1 NOREF#81.1 NOREF#82.5 NOREF#85.5 NOREF#104.1 U1.9 U1#2.9 U1#3.9 U3.14 U3#2.14 U3#3.14 U3#4.14 U3#5.14 U3#6.14 U3#7.14 U3#8.14
SDA: NOREF#7.1 NOREF#12.1 NOREF#23.1 NOREF#30.4 NOREF#45.1 NOREF#61.1 NOREF#70.1 NOREF#71.4 NOREF#77.1 NOREF#84.1 NOREF#88.4 U1.8 U1#2.8 U1#3.8 U3.13 U3#2.13 U3#3.13 U3#4.13 U3#5.13 U3#6.13 U3#7.13 U3#8.13
SWIO: NOREF#13.1 NOREF#47.1 NOREF#103.1 U1.15 U1#2.15 U1#3.15
TX: LED30.1 LED30#2.1 LED30#3.1 NOREF#35.4 NOREF#72.4 NOREF#93.4 R23.1 R23#2.1 R23#3.1
UPDI: NOREF#25.1 NOREF#27.1 NOREF#48.2 NOREF#52.1 NOREF#58.2 NOREF#64.1 NOREF#89.1 NOREF#90.1 NOREF#98.2 NOREF#106.1 NOREF#107.1 R20.1 R20#2.1 R20#3.1 U3.19 U3#2.19 U3#3.19 U3#4.19 U3#5.19 U3#6.19 U3#7.19 U3#8.19 U4.9 U4#2.9 U4#3.9
$1N428: LED1.1 LED1#2.1 LED1#3.1 R2.1 R2#2.1 R2#3.1
$1N967: R1.1 R1#2.1 R1#3.1 SW1.3 SW1.4 SW1#2.3 SW1#2.4 SW1#3.3 SW1#3.4 U1.1 U1#2.1 U1#3.1
$1N1600: LED2.2 LED2#2.2 LED2#3.2 LED3.2 LED3#2.2 LED3#3.2 LED4.2 LED4#2.2 LED4#3.2 LED5.2 LED5#2.2 LED5#3.2 R3.1 R3#2.1 R3#3.1
$1N2357: LED6.2 LED6#2.2 LED6#3.2 LED7.2 LED7#2.2 LED7#3.2 LED8.2 LED8#2.2 LED8#3.2 LED9.2 LED9#2.2 LED9#3.2 R4.1 R4#2.1 R4#3.1
$1N2614: LED10.2 LED10#2.2 LED10#3.2 LED11.2 LED11#2.2 LED11#3.2 LED12.2 LED12#2.2 LED12#3.2 LED13.2 LED13#2.2 LED13#3.2 R5.1 R5#2.1 R5#3.1
$1N3015: LED14.2 LED14#2.2 LED14#3.2 LED15.2 LED15#2.2 LED15#3.2 LED16.2 LED16#2.2 LED16#3.2 LED17.2 LED17#2.2 LED17#3.2 R6.1 R6#2.1 R6#3.1
$1N3272: LED18.2 LED18#2.2 LED18#3.2 LED19.2 LED19#2.2 LED19#3.2 LED20.2 LED20#2.2 LED20#3.2 LED21.2 LED21#2.2 LED21#3.2 R7.1 R7#2.1 R7#3.1
$1N4160: R9.2 R9#2.2 R9#3.2 USB1.B5 USB1#2.B5 USB1#3.B5
$1N4165: R8.2 R8#2.2 R8#3.2 USB1.A5 USB1#2.A5 USB1#3.A5
$1N8336: R12.2 R12#2.2 R12#3.2 R12#4.2 R12#5.2 R12#6.2 R12#7.2 R12#8.2 USB.A5 USB#2.A5 USB#3.A5 USB#4.A5 USB#5.A5 USB#6.A5 USB#7.A5 USB#8.A5
$1N8340: R11.2 R11#2.2 R11#3.2 R11#4.2 R11#5.2 R11#6.2 R11#7.2 R11#8.2 USB.B5 USB#2.B5 USB#3.B5 USB#4.B5 USB#5.B5 USB#6.B5 USB#7.B5 USB#8.B5
$1N8511: LED22.3 LED22#2.3 LED22#3.3 LED22#4.3 LED22#5.3 LED22#6.3 LED22#7.3 LED22#8.3 LED23.1 LED23#2.1 LED23#3.1 LED23#4.1 LED23#5.1 LED23#6.1 LED23#7.1 LED23#8.1
$1N16182: R13.2 R13#2.2 R13#3.2 USB2.4 USB2#2.4 USB2#3.4
$1N16183: R14.2 R14#2.2 R14#3.2 USB2.10 USB2#2.10 USB2#3.10
$1N17922: R16.2 R16#2.2 R16#3.2 USB3.10 USB3#2.10 USB3#3.10
$1N17923: R15.2 R15#2.2 R15#3.2 USB3.4 USB3#2.4 USB3#3.4
$1N18529: LED24.2 LED24#2.2 LED24#3.2 R17.1 R17#2.1 R17#3.1
$1N18636: LED25.2 LED25#2.2 LED25#3.2 R18.1 R18#2.1 R18#3.1
$1N18732: R19.2 R19#2.2 R19#3.2 U4.6 U4#2.6 U4#3.6
$1N18734: LED26.2 LED26#2.2 LED26#3.2 R19.1 R19#2.1 R19#3.1
$1N19203: R20.2 R20#2.2 R20#3.2 U4.8 U4#2.8 U4#3.8
$1N21642: LED28.2 LED28#2.2 LED28#3.2 R22.1 R22#2.1 R22#3.1
$1N21643: R22.2 R22#2.2 R22#3.2 U7.6 U7#2.6 U7#3.6
$1N21653: R23.2 R23#2.2 R23#3.2 U7.8 U7#2.8 U7#3.8
$1N21686: R24.2 R24#2.2 R24#3.2 U7.9 U7#2.9 U7#3.9
$1N21796: LED29.2 LED29#2.2 LED29#3.2 R25.1 R25#2.1 R25#3.1
$1N21889: LED30.2 LED30#2.2 LED30#3.2 R26.1 R26#2.1 R26#3.1

Pads without a net: LED23 3; LED23#2 3; LED23#3 3; LED23#4 3; LED23#5 3; LED23#6 3; LED23#7 3; LED23#8 3; SW1 5 6; SW1#2 5 6; SW1#3 5 6; SW2 5 6; SW2#2 5 6; SW2#3 5 6; U2 4; U2#2 4; U2#3 4; U3 1 5 6 8 9 10 11 15 16 17 18 20; U3#2 1 5 6 8 9 10 11 15 16 17 18 20; U3#3 1 5 6 8 9 10 11 15 16 17 18 20; U3#4 1 5 6 8 9 10 11 15 16 17 18 20; U3#5 1 5 6 8 9 10 11 15 16 17 18 20; U3#6 1 5 6 8 9 10 11 15 16 17 18 20; U3#7 1 5 6 8 9 10 11 15 16 17 18 20; U3#8 1 5 6 8 9 10 11 15 16 17 18 20; U4 4 5; U4#2 4 5; U4#3 4 5; U6 4; U6#2 4; U6#3 4; U7 4 5; U7#2 4 5; U7#3 4 5; USB2 2 3 9 11; USB2#2 2 3 9 11; USB2#3 2 3 9 11; USB3 3 9; USB3#2 3 9; USB3#3 3 9

## Via types
v1: diameter 0.5, hole 0.305, Top Layer to Bottom Layer, 249 vias
v2: diameter 0.65, hole 0.4, Top Layer to Bottom Layer, 69 vias

## Routing (per net, layer and track width the routed paths; a pad name or vN(x,y) marks a point on that pad's centre or on a via; arc(x,y) is an arc through that point)
+3.3V: length 90
  Top Layer w0.154: U1#3.6 11.72,60.78 arc(12.07,60.26) C1.1 ; 11.58,10.03 11.61,10 arc(11.97,9.47) 12.09,8.85 ; U1.6 11.66,35.39 arc(12.02,34.86) C1#2.1
  Top Layer w0.2: R18.2 v1(42.91,48.54) ; v1(43.2,62.84) 42.02,62.84 arc(41.74,62.96) 41.62,63.24 ; R18#2.2 v1(42.96,21.55) ; v1(43.25,35.84) 42.07,35.84 arc(41.79,35.96) SW3.1 ; v1(43.3,8.84) 42.12,8.84 arc(41.84,8.96) SW3#2.1 ; R18#3.2 v1(42.86,75.54)
  Top Layer w0.28: SW3#2.1 40.89,9.24 arc(40.74,9.31) 40.67,9.46 arc(40.31,9.61) 40.16,9.98 40.16,16.24 ; 41.62,63.24 40.79,63.24 arc(40.63,63.3) 40.57,63.46 arc(40.21,63.61) 40.06,63.97 U4#3.10 ; U4.10 40.11,36.97 arc(40.26,36.61) 40.62,36.46 arc(40.68,36.3) 40.84,36.24 SW3.1
  Bottom Layer w0.2: v1(43.25,35.84) 44.07,35.84 arc(44.32,35.95) 44.43,36.2 44.43,43.32 arc(44.51,43.5) 44.68,43.57 44.94,43.57 arc(45.12,43.64) 45.19,43.82 45.19,48.9 arc(45.04,49.26) 44.68,49.41 43.42,49.41 arc(43.06,49.26) 42.91,48.9 v1(42.91,48.54) ; v1(42.96,21.55) 42.96,21.91 arc(43.11,22.27) 43.47,22.42 44.74,22.42 arc(45.1,22.27) 45.24,21.91 45.24,16.83 arc(45.17,16.65) 44.99,16.57 44.74,16.57 arc(44.56,16.5) 44.48,16.32 44.48,9.21 arc(44.38,8.95) 44.12,8.84 v1(43.3,8.84) ; v1(43.2,62.84) 44.01,62.84 arc(44.27,62.95) 44.38,63.2 44.38,70.32 arc(44.45,70.5) 44.63,70.57 44.89,70.57 arc(45.07,70.64) 45.14,70.82 45.14,75.9 arc(44.99,76.26) 44.63,76.41 43.36,76.41 arc(43,76.26) 42.86,75.9 v1(42.86,75.54)
  vias: v2(31.11,64.13) v2(31.11,63.15) v2(31.16,37.13) v2(31.16,36.15) v2(31.21,10.14) v2(31.21,9.15) v2(40.06,62.68) v2(40.06,61.7) v2(40.11,35.68) v2(40.11,34.7) v2(40.17,8.68) v2(40.17,7.7)
+5V: length 272.9
  Top Layer w0.2: 52.38,82.59 C6#4.2 C7#4.1 ; 52.38,82.59 arc(52.43,82.45) 52.57,82.39 ; 52.38,82.59 arc(52.32,82.45) 52.18,82.39 ; 52.47,42.51 C6#2.2 C7#2.1 ; 52.47,42.51 arc(52.41,42.37) 52.27,42.32 ; 52.47,42.51 arc(52.53,42.37) 52.67,42.32 ; 51.03,71.43 51.03,71.56 arc(50.97,71.7) 50.83,71.76 ; 51.03,71.43 v1(51.03,71.25) ; 51.03,71.43 arc(51.15,71.71) 51.43,71.83 ; 51.26,11.72 LED23#4.2 arc(50.49,11.72) 50.49,11.71 50.49,10.95 ; 51.26,11.72 51.53,11.72 ; 51.26,11.72 arc(51.09,11.7) 50.93,11.65 ; v1(51.04,51.21) 51.04,51.4 ; 51.04,51.4 51.04,51.52 arc(50.98,51.66) 50.83,51.72 ; 51.04,51.4 arc(51.15,51.68) 51.43,51.79 ; 52.28,22.28 52.06,22.28 arc(51.88,22.2) 51.8,22.02 arc(51.72,21.82) 51.52,21.74 ; 52.28,22.28 52.67,22.28 ; 52.28,22.28 arc(52.42,22.33) 52.48,22.47 ; 52.67,22.28 arc(52.85,22.2) 52.93,22.02 ; 52.67,22.28 arc(52.54,22.33) 52.48,22.47 ; v1(51.03,61.23) 51.03,61.42 ; 51.03,61.42 51.03,61.54 arc(50.97,61.68) 50.82,61.74 ; 51.03,61.42 arc(51.14,61.7) 51.42,61.81 ; C7#6.1 C6#6.2 52.39,72.57 ; 52.19,72.37 52.58,72.37 ; 52.19,72.37 51.97,72.37 arc(51.79,72.3) 51.71,72.12 arc(51.63,71.92) 51.43,71.83 ; 52.19,72.37 arc(52.33,72.43) 52.39,72.57 ; 52.58,72.37 arc(52.76,72.3) 52.84,72.12 ; 52.58,72.37 arc(52.44,72.43) 52.39,72.57 ; 52.29,12.26 52.69,12.26 ; 52.29,12.26 52.07,12.26 arc(51.89,12.18) 51.82,12 arc(51.73,11.8) 51.53,11.72 ; 52.29,12.26 arc(52.43,12.32) 52.49,12.45 ; 52.69,12.26 arc(52.55,12.32) 52.49,12.45 ; 52.69,12.26 arc(52.87,12.18) 52.94,12 ; LED22#3.2 50.47,41.01 ; 50.47,41.01 50.47,41.77 arc(50.47,41.77) LED23#2.2 51.24,41.77 ; 50.47,41.01 arc(50.59,41.42) 50.91,41.7 ; v1(51.02,81.27) 51.02,81.45 ; 51.02,81.45 51.02,81.57 arc(50.96,81.72) 50.82,81.78 ; 51.02,81.45 arc(51.13,81.73) 51.41,81.85 ; 52.2,52.33 52.59,52.33 ; 52.2,52.33 51.97,52.33 arc(51.79,52.26) 51.72,52.08 arc(51.64,51.88) 51.43,51.79 ; 52.2,52.33 arc(52.34,52.39) 52.39,52.53 ; 52.59,52.33 arc(52.77,52.26) 52.84,52.08 ; 52.59,52.33 arc(52.45,52.39) 52.39,52.53 ; 53.32,62.91 C6#5.2 52.38,62.55 ; 51.24,21.74 51.52,21.74 ; 51.24,21.74 LED23.2 arc(50.48,21.74) 50.48,21.73 50.48,20.97 ; 51.24,21.74 arc(51.08,21.72) 50.92,21.66 ; 51.52,21.74 arc(51.24,21.62) 51.12,21.34 ; 50.39,71.07 50.39,71.83 arc(50.39,71.83) LED23#7.2 51.15,71.83 ; 50.39,71.07 LED22#7.2 ; 50.39,71.07 arc(50.51,71.48) 50.83,71.76 ; 52.84,72.12 52.84,72.17 arc(53.01,72.59) 53.43,72.76 ; 52.84,72.12 U3#7.4 ; LED22#4.2 50.49,10.95 ; 50.49,10.95 arc(50.61,11.36) 50.93,11.65 ; U3#2.4 52.92,42.06 ; 52.92,42.06 52.92,42.11 arc(53.1,42.53) 53.52,42.71 ; 52.92,42.06 arc(52.85,42.24) 52.67,42.32 ; U3.4 52.93,22.02 ; 52.93,22.02 52.93,22.07 arc(53.1,22.5) 53.53,22.67 ; 52.19,62.35 51.96,62.35 arc(51.78,62.28) 51.71,62.1 arc(51.62,61.9) 51.42,61.81 ; 52.19,62.35 52.58,62.35 ; 52.19,62.35 arc(52.33,62.41) 52.38,62.55 ; v1(51.13,11.14) 51.13,11.32 ; 51.13,11.32 51.13,11.44 arc(51.07,11.59) 50.93,11.65 ; 51.13,11.32 arc(51.25,11.6) 51.53,11.72 ; 52.18,82.39 51.95,82.39 arc(51.77,82.32) 51.7,82.14 arc(51.62,81.93) 51.41,81.85 ; 52.18,82.39 52.57,82.39 ; 51.15,71.83 51.43,71.83 ; 51.15,71.83 arc(50.99,71.81) 50.83,71.76 ; 51.25,31.76 LED23#3.2 arc(50.48,31.75) 50.48,31.75 50.48,30.99 ; 51.25,31.76 51.52,31.76 ; 51.25,31.76 arc(51.08,31.74) 50.92,31.68 ; 52.94,12 52.94,12.05 arc(53.11,12.48) 53.54,12.65 ; 52.94,12 U3#4.4 ; 52.82,82.14 52.82,82.19 arc(53,82.61) 53.42,82.78 ; 52.82,82.14 U3#5.4 ; 52.82,82.14 arc(52.75,82.32) 52.57,82.39 ; 52.83,62.1 52.83,62.15 arc(53.01,62.57) 53.43,62.75 ; 52.83,62.1 52.83,61.47 ; 52.83,62.1 arc(52.76,62.28) 52.58,62.35 ; 51.14,81.85 51.41,81.85 ; 51.14,81.85 LED23#5.2 arc(50.38,81.85) 50.38,81.85 50.38,81.09 ; 51.14,81.85 arc(50.97,81.83) 50.82,81.78 ; v1(55.11,33.05) D2#4.2 ; v1(51.12,21.16) 51.12,21.34 ; 51.12,21.34 51.12,21.46 arc(51.06,21.61) 50.92,21.66 ; C7#3.1 C6#3.2 52.48,32.49 ; v1(51.11,41.19) 51.11,41.38 ; 51.11,41.38 51.11,41.5 arc(51.05,41.64) 50.91,41.7 ; 51.11,41.38 arc(51.23,41.66) 51.51,41.77 ; 50.4,51.03 50.4,51.79 arc(50.39,51.79) LED23#8.2 51.16,51.79 ; 50.4,51.03 LED22#8.2 ; 50.4,51.03 arc(50.51,51.44) 50.83,51.72 ; 52.29,32.3 52.68,32.3 ; 52.29,32.3 52.06,32.3 arc(51.88,32.22) 51.81,32.04 arc(51.72,31.84) 51.52,31.76 ; 52.29,32.3 arc(52.42,32.35) 52.48,32.49 ; 52.68,32.3 arc(52.86,32.22) 52.93,32.04 ; 52.68,32.3 arc(52.54,32.35) 52.48,32.49 ; LED22#2.2 50.48,30.99 ; 50.48,30.99 arc(50.6,31.4) 50.92,31.68 ; U3#3.4 52.93,32.04 ; 52.93,32.04 52.93,32.09 arc(53.11,32.51) 53.53,32.69 ; 52.58,62.35 arc(52.44,62.41) 52.38,62.55 ; 52.84,52.08 52.84,52.13 arc(53.02,52.55) 53.44,52.73 ; 52.84,52.08 U3#8.4 ; 51.13,31.36 51.13,31.48 arc(51.07,31.62) 50.92,31.68 ; 51.13,31.36 v1(51.13,31.17) ; 51.13,31.36 arc(51.24,31.64) 51.52,31.76 ; 51.16,51.79 51.43,51.79 ; 51.16,51.79 arc(50.99,51.77) 50.83,51.72 ; 51.15,61.81 LED23#6.2 arc(50.38,61.81) 50.39,61.81 50.39,61.05 ; 51.15,61.81 51.42,61.81 ; 51.15,61.81 arc(50.98,61.79) 50.82,61.74 ; 51.24,41.77 51.51,41.77 ; 51.24,41.77 arc(51.07,41.76) 50.91,41.7 ; 51.51,41.77 arc(51.71,41.86) 51.8,42.06 arc(51.87,42.24) 52.05,42.32 52.27,42.32 ; v1(55.02,53.08) D2.2 ; 52.27,42.32 52.67,42.32 ; v1(55.11,23.03) D2#2.2 ; C7#8.1 C6#8.2 52.49,12.45 ; v1(55,83.14) D2#6.2 ; LED22#6.2 50.39,61.05 ; 50.39,61.05 arc(50.5,61.46) 50.82,61.74 ; 50.38,81.09 50.38,80.37 ; 50.38,81.09 arc(50.5,81.5) 50.82,81.78 ; LED22.2 50.48,20.97 ; 50.48,20.97 arc(50.6,21.38) 50.92,21.66 ; C7#7.1 C6#7.2 52.39,52.53 ; v1(55.12,13.01) D2#5.2 ; v1(55.01,63.1) D2#7.2 ; v1(55.01,73.12) D2#8.2 ; v1(55.1,43.07) D2#3.2 ; 53.42,22.84 C6.2 52.48,22.47
  Bottom Layer w0.2: v1(56.02,76.44) 54.35,76.44 arc(54.09,76.55) 53.99,76.8 53.99,77.87 arc(54,77.9) 54.02,77.91 arc(54.18,77.85) 54.24,77.69 54.24,77.06 arc(54.31,76.88) 54.49,76.8 55.76,76.8 arc(55.94,76.88) v1(56.02,77.06) ; v1(56.04,46.39) 54.36,46.39 arc(54.11,46.49) 54.01,46.75 54.01,47.82 arc(54.02,47.84) 54.04,47.85 arc(54.2,47.79) 54.26,47.64 54.26,47 arc(54.33,46.82) 54.51,46.75 55.78,46.75 arc(55.96,46.82) v1(56.04,47) ; v1(56.03,66.42) 54.36,66.42 arc(54.1,66.53) 54,66.78 54,67.85 arc(54.01,67.88) 54.04,67.89 arc(54.19,67.83) 54.25,67.67 54.25,67.04 arc(54.33,66.86) 54.51,66.78 55.77,66.78 arc(55.96,66.86) v1(56.03,67.04) ; v1(56.13,6.31) 54.46,6.31 arc(54.21,6.42) 54.1,6.67 54.1,7.74 arc(54.11,7.77) 54.14,7.78 arc(54.29,7.71) 54.36,7.56 54.36,6.92 arc(54.43,6.74) 54.61,6.67 55.88,6.67 arc(56.06,6.75) v1(56.13,6.93) ; v1(56.13,26.35) 54.45,26.35 arc(54.2,26.45) 54.09,26.71 54.09,27.78 arc(54.1,27.8) 54.13,27.82 arc(54.28,27.75) 54.35,27.6 54.35,26.96 arc(54.42,26.78) 54.6,26.71 55.87,26.71 arc(56.05,26.78) v1(56.13,26.96) ; v1(56.03,56.41) 54.35,56.41 arc(54.1,56.51) 53.99,56.76 53.99,57.83 arc(54.01,57.86) 54.03,57.87 arc(54.19,57.81) 54.25,57.65 54.25,57.02 arc(54.32,56.84) 54.5,56.76 55.77,56.76 arc(55.95,56.84) v1(56.03,57.02) ; v1(56.11,36.37) 54.44,36.37 arc(54.19,36.47) 54.08,36.73 54.08,37.8 arc(54.09,37.82) 54.12,37.83 arc(54.27,37.77) 54.34,37.62 54.34,36.98 arc(54.41,36.8) 54.59,36.73 55.86,36.73 arc(56.04,36.8) v1(56.11,36.98) ; v1(56.12,16.33) 54.45,16.33 arc(54.2,16.44) 54.09,16.69 54.09,17.76 arc(54.1,17.79) 54.13,17.8 arc(54.28,17.73) 54.35,17.58 54.35,16.94 arc(54.42,16.76) 54.6,16.69 55.87,16.69 arc(56.05,16.76) v1(56.12,16.94)
  Bottom Layer w0.4: 54.03,57.87 54.03,58.6 ; 54.03,58.6 54.03,62.12 ; 54.03,58.6 arc(53.81,59.12) 53.29,59.34 51.73,59.34 arc(51.21,59.12) 50.99,58.6 ; 54.14,7.78 54.14,8.5 ; 54.14,8.5 54.14,12.03 ; 54.14,8.5 arc(53.92,9.03) 53.4,9.24 51.84,9.24 arc(51.32,9.03) 51.1,8.5 ; 50.99,67.89 50.99,68.62 ; 50.99,68.62 50.99,71.22 arc(51,71.24) v1(51.03,71.25) 53.14,71.25 arc(53.77,71.51) 54.04,72.14 ; 50.99,68.62 arc(51.21,69.14) 51.74,69.36 53.29,69.36 arc(53.82,69.14) 54.04,68.62 ; 51.08,38.56 51.08,41.16 arc(51.09,41.18) v1(51.11,41.19) 53.23,41.19 arc(53.86,41.46) 54.12,42.09 ; 51.08,38.56 51.08,37.83 ; 51.08,38.56 arc(51.3,39.08) 51.82,39.3 53.38,39.3 arc(53.9,39.08) 54.12,38.56 ; 54.04,48.58 54.04,52.1 ; 54.04,48.58 54.04,47.85 ; 54.04,48.58 arc(53.83,49.1) 53.3,49.32 51.74,49.32 arc(51.22,49.1) 51,48.58 ; 54.04,52.1 arc(54.33,52.8) v1(55.02,53.08) ; 54.04,52.1 arc(53.78,51.47) 53.15,51.21 v1(51.04,51.21) arc(51.01,51.2) 51,51.18 51,48.58 ; 51.1,7.78 51.1,8.5 ; 51.1,8.5 51.1,11.1 arc(51.11,11.13) v1(51.13,11.14) 53.25,11.14 arc(53.88,11.4) 54.14,12.03 ; 54.02,78.63 54.02,82.16 ; 54.02,78.63 54.02,77.91 ; 54.02,78.63 arc(53.81,79.16) 53.28,79.38 51.73,79.38 arc(51.2,79.16) 50.98,78.63 ; 54.02,82.16 arc(53.76,81.53) 53.13,81.27 v1(51.02,81.27) arc(50.99,81.26) 50.98,81.23 50.98,78.63 ; 54.02,82.16 arc(54.31,82.85) v1(55,83.14) ; 50.98,77.91 50.98,78.63 ; 54.12,38.56 54.12,42.09 ; 54.12,38.56 54.12,37.83 ; 54.12,42.09 arc(54.41,42.78) v1(55.1,43.07) ; 54.04,68.62 54.04,72.14 ; 54.04,68.62 54.04,67.89 ; 54.04,72.14 arc(54.32,72.83) v1(55.01,73.12) ; 51.09,28.54 51.09,31.14 arc(51.1,31.16) v1(51.13,31.17) 53.24,31.17 arc(53.87,31.44) 54.13,32.07 ; 51.09,28.54 51.09,27.82 ; 51.09,28.54 arc(51.31,29.07) 51.83,29.28 53.39,29.28 arc(53.91,29.07) 54.13,28.54 ; 54.03,62.12 arc(53.77,61.49) 53.14,61.23 v1(51.03,61.23) arc(51,61.22) 50.99,61.2 50.99,58.6 ; 54.03,62.12 arc(54.32,62.82) v1(55.01,63.1) ; 50.99,58.6 50.99,57.87 ; 51,48.58 51,47.85 ; 54.13,27.82 54.13,28.54 ; 54.13,28.54 54.13,32.07 ; 54.13,18.52 54.13,22.05 ; 54.13,18.52 54.13,17.8 ; 54.13,18.52 arc(53.91,19.05) 53.39,19.26 51.83,19.26 arc(51.31,19.05) 51.09,18.52 ; 54.13,22.05 arc(54.41,22.74) v1(55.11,23.03) ; 54.13,22.05 arc(53.87,21.42) 53.23,21.16 v1(51.12,21.16) arc(51.1,21.15) 51.09,21.12 51.09,18.52 ; 51.09,17.8 51.09,18.52 ; 54.13,32.07 arc(54.42,32.76) v1(55.11,33.05) ; 54.14,12.03 arc(54.43,12.72) v1(55.12,13.01)
GND: length 179.7
  Top Layer w0.127: U3#6.21 U3#6.3 ; 54.85,22.19 54.24,22.19 ; 54.24,22.19 53.71,22.19 arc(53.46,22.09) 53.36,21.84 ; 54.24,22.19 arc(54.16,22.23) 54.12,22.31 ; U3#3.21 U3#3.3 ; 54.25,12.17 53.73,12.17 arc(53.47,12.07) 53.37,11.82 ; 54.25,12.17 54.86,12.17 ; 54.25,12.17 arc(54.17,12.21) 54.13,12.29 ; 54.84,42.23 54.23,42.23 ; 54.23,42.23 53.71,42.23 arc(53.45,42.13) 53.35,41.87 ; 54.23,42.23 arc(54.15,42.26) 54.11,42.35 ; v1(9.04,58.39) 9.24,58.58 9.24,60.3 9.47,60.54 9.85,60.54 10.41,61.1 U1#3.4 11.19,61.88 U1#3.21 ; 54.14,72.29 53.62,72.29 arc(53.37,72.18) 53.26,71.93 ; 54.14,72.29 54.76,72.29 ; 54.14,72.29 arc(54.06,72.32) 54.03,72.4 ; U3#2.21 U3#2.3 ; U3#5.21 U3#5.3 ; 54.15,52.25 53.63,52.25 arc(53.38,52.14) 53.27,51.89 ; 54.15,52.25 54.77,52.25 ; 54.15,52.25 arc(54.07,52.28) 54.04,52.36 ; U3#7.21 U3#7.3 ; U3.21 U3.3 ; v1(8.99,33) 9.18,33.19 9.18,34.91 9.41,35.14 9.79,35.14 10.35,35.71 U1.4 11.14,36.48 U1.21 ; 54.75,82.31 54.13,82.31 ; 54.13,82.31 53.61,82.31 arc(53.36,82.2) 53.25,81.95 ; 54.13,82.31 arc(54.05,82.34) 54.02,82.42 ; 54.24,32.21 53.72,32.21 arc(53.47,32.11) 53.36,31.85 ; 54.24,32.21 54.85,32.21 ; 54.24,32.21 arc(54.16,32.25) 54.13,32.33 ; U1#2.21 11.09,11.09 10.31,10.31 10.3,10.31 9.74,9.75 9.36,9.75 9.13,9.52 9.13,7.8 v1(8.94,7.6) ; 54.76,62.27 54.14,62.27 ; 54.14,62.27 53.62,62.27 arc(53.37,62.16) 53.26,61.91 ; 54.14,62.27 arc(54.06,62.3) 54.03,62.38 ; U3#4.21 U3#4.3 ; U3#8.21 U3#8.3
  Top Layer w0.13: 54.3,32.64 54.32,32.62 arc(54.38,32.57) 54.46,32.56 ; 54.54,22.57 54.53,22.58 arc(54.46,22.63) 54.38,22.65 ; D2#8.1 55.78,71.76 ; 54.45,72.67 54.44,72.68 arc(54.37,72.72) 54.29,72.74 ; 54.45,52.63 54.44,52.64 arc(54.38,52.69) 54.29,52.7 ; 54.55,12.56 54.54,12.56 arc(54.47,12.61) 54.39,12.63 ; 54.53,42.61 54.52,42.62 arc(54.45,42.67) 54.37,42.68 ; 54.54,32.59 54.53,32.6 arc(54.46,32.65) 54.38,32.67 ; D2#3.1 55.86,41.7 ; 54.31,12.6 54.32,12.58 arc(54.39,12.54) 54.47,12.52 ; D2.1 55.78,51.72 ; 54.2,72.71 54.22,72.69 arc(54.29,72.65) 54.36,72.63 ; D2#2.1 55.87,21.66 ; 54.44,62.65 54.43,62.66 arc(54.36,62.71) 54.28,62.72 ; 54.43,82.69 54.43,82.7 arc(54.36,82.74) 54.27,82.76 ; 54.21,52.67 54.23,52.66 arc(54.29,52.61) 54.37,52.6 ; 54.2,62.69 54.22,62.68 arc(54.28,62.63) 54.36,62.62 ; 54.3,22.62 54.31,22.6 arc(54.38,22.56) 54.46,22.54 ; D2#6.1 55.76,81.78 ; D2#5.1 55.88,11.64 ; D2#7.1 55.77,61.74 ; 54.29,42.66 54.3,42.64 arc(54.37,42.59) 54.45,42.58 ; D2#4.1 55.87,31.68 ; 54.19,82.73 54.21,82.71 arc(54.28,82.67) 54.35,82.65 ; 54.56,82.64 arc(54.3,82.59) 54.08,82.45 ; 54.68,12.51 arc(54.42,12.46) 54.2,12.31 ; 54.58,52.59 arc(54.32,52.54) 54.1,52.39 ; 54.67,32.55 arc(54.41,32.5) 54.19,32.35 ; 54.57,72.63 arc(54.31,72.57) 54.1,72.43 ; 54.57,62.61 arc(54.31,62.56) 54.09,62.41 ; 54.66,42.57 arc(54.4,42.52) 54.18,42.37 ; 54.67,22.53 arc(54.41,22.48) 54.19,22.33
  Top Layer w0.154: SW2#3.2 3.56,57.28 2.81,58.03 2.81,61.93 3.34,62.46 ; 3.34,62.46 3.73,62.85 SW1#3.1 ; 3.34,62.46 7.01,62.46 7.48,62.93 SW1#3.2 ; 3.28,37.07 6.96,37.07 7.42,37.54 SW1.2 ; 3.28,37.07 3.67,37.46 SW1.1 ; 3.28,37.07 2.75,36.54 2.75,32.64 3.51,31.89 SW2.2 ; SW1#2.1 3.62,12.07 3.23,11.68 ; 3.23,11.68 2.7,11.14 2.7,7.25 3.46,6.49 SW2#2.2 ; 3.23,11.68 6.91,11.68 7.37,12.14 SW1#2.2
  Top Layer w0.18: U3#7.3 53.24,72.12 arc(53.32,72.32) 53.52,72.4 53.95,72.4 arc(54.1,72.46) 54.16,72.61 C7#6.2 ; U3#6.3 53.23,62.1 arc(53.32,62.3) 53.52,62.38 53.95,62.38 arc(54.1,62.44) 54.16,62.6 54.16,62.91 ; C7#8.2 54.27,12.5 arc(54.21,12.35) 54.05,12.29 53.62,12.29 arc(53.42,12.2) 53.34,12 U3#4.3 ; 54.25,42.87 54.25,42.56 arc(54.19,42.41) 54.03,42.34 53.6,42.34 arc(53.4,42.26) 53.32,42.06 U3#2.3 ; U3.3 53.33,22.02 arc(53.41,22.22) 53.61,22.31 54.04,22.31 arc(54.19,22.37) 54.26,22.52 C7.2 ; C7#3.2 54.26,32.54 arc(54.2,32.39) 54.05,32.32 53.61,32.32 arc(53.41,32.24) 53.33,32.04 U3#3.3 ; U3#5.3 53.22,82.14 arc(53.31,82.34) 53.51,82.42 53.94,82.42 arc(54.09,82.48) 54.15,82.63 54.15,82.95 ; U3#8.3 53.24,52.08 arc(53.33,52.28) 53.53,52.36 53.96,52.36 arc(54.11,52.42) 54.17,52.58 C7#7.2
  Top Layer w0.2: R14#3.1 36.61,77.02 USB2#3.12 ; 49.61,22.26 49.25,22.26 arc(49.07,22.19) 49,22.01 49,21.46 arc(49,21.42) 49.02,21.37 ; 49.52,72.36 49.16,72.36 arc(48.98,72.28) 48.91,72.11 48.91,71.56 arc(48.91,71.51) 48.92,71.47 ; R14.1 36.66,50.02 USB2.12 ; C10#2.2 33.92,75.84 C9#2.1 ; 48.66,31.87 48.93,31.87 arc(48.96,31.88) 48.98,31.89 ; R14#2.1 36.71,23.03 36.71,24.36 ; 48.64,41.89 48.92,41.89 arc(48.95,41.9) 48.97,41.91 ; 49.51,82.38 49.15,82.38 arc(48.97,82.3) 48.89,82.13 48.89,81.58 arc(48.9,81.53) 48.91,81.48 ; 48.56,71.95 48.84,71.95 arc(48.86,71.95) 48.88,71.97 ; v2(28.18,48.22) 28.18,49.26 ; C10.2 34.02,21.85 C9.1 ; C10#3.2 33.97,48.84 C9#3.1 ; 48.57,51.91 48.85,51.91 arc(48.87,51.91) 48.89,51.93 ; 49.6,42.3 49.24,42.3 arc(49.06,42.23) 48.99,42.05 48.99,41.5 arc(48.99,41.45) 49.01,41.41 ; 48.65,21.85 48.93,21.85 arc(48.95,21.86) 48.97,21.87 ; 49.62,12.25 49.26,12.25 arc(49.08,12.17) 49.01,11.99 49.01,11.44 arc(49.01,11.4) 49.03,11.35 ; 48.55,81.97 48.83,81.97 arc(48.85,81.97) 48.87,81.98 ; 48.56,61.93 48.84,61.93 arc(48.86,61.93) 48.88,61.95 ; v2(28.23,21.22) 28.23,22.27 ; 49.52,62.34 49.16,62.34 arc(48.98,62.27) 48.9,62.09 48.9,61.54 arc(48.91,61.49) 48.92,61.45 ; 49.61,32.28 49.25,32.28 arc(49.08,32.21) 49,32.03 49,31.48 arc(49.01,31.44) 49.02,31.39 ; 48.66,11.83 48.94,11.83 arc(48.97,11.84) 48.98,11.85 ; 49.53,52.32 49.17,52.32 arc(48.99,52.25) 48.91,52.07 48.91,51.52 arc(48.92,51.47) 48.93,51.43 ; v2(28.13,75.22) 28.13,76.26
  Top Layer w0.254: U4.3 39.11,48.37 arc(38.99,48.64) 38.72,48.75 36.95,48.75 ; U4#2.3 39.16,21.37 arc(39.05,21.64) 38.78,21.75 37,21.75 ; U4#3.3 39.06,75.37 arc(38.94,75.64) 38.67,75.75 36.89,75.75
  Top Layer w0.4: R9#2.1 R8#2.1 ; R9.1 R8.1 ; R9#3.1 R8#3.1
  Bottom Layer w0.127: 49.75,77.91 49.75,76.69 arc(49.8,76.57) 49.92,76.52 R12#5.1 ; 50.54,56.47 50.61,56.41 arc(50.87,56.23) 51.19,56.17 51.88,56.17 arc(52.22,56.23) 52.51,56.43 ; R12#7.1 49.93,66.5 arc(49.81,66.55) 49.77,66.67 49.77,67.89 ; 50.54,66.49 50.61,66.42 arc(50.88,66.25) 51.19,66.18 51.88,66.18 arc(52.23,66.25) 52.52,66.45 ; R12#8.1 49.94,46.46 arc(49.82,46.51) 49.77,46.63 49.77,47.85 ; 50.64,26.42 50.7,26.35 arc(50.97,26.17) 51.29,26.11 51.98,26.11 arc(52.32,26.18) 52.61,26.37 ; 49.85,37.83 49.85,36.61 arc(49.9,36.5) 50.02,36.45 R12#3.1 ; R12#4.1 50.04,6.39 arc(49.92,6.44) 49.87,6.56 49.87,7.78 ; 50.55,46.45 50.62,46.39 arc(50.88,46.21) 51.2,46.15 51.89,46.15 arc(52.24,46.21) 52.53,46.41 ; R12#2.1 50.03,26.43 arc(49.91,26.48) 49.86,26.6 49.86,27.82 ; 50.64,16.4 50.7,16.33 arc(50.97,16.15) 51.28,16.09 51.98,16.09 arc(52.32,16.16) 52.61,16.35 ; 50.66,16.41 50.03,16.41 arc(49.91,16.46) 49.86,16.58 49.86,17.8 ; 50.53,76.51 50.6,76.44 arc(50.86,76.27) 51.18,76.2 51.87,76.2 arc(52.22,76.27) 52.51,76.47 ; 49.76,57.87 49.76,56.65 arc(49.81,56.53) 49.93,56.48 R12#6.1 ; 50.63,36.44 50.69,36.37 arc(50.96,36.19) 51.27,36.13 51.97,36.13 arc(52.31,36.2) 52.6,36.39 ; 50.65,6.38 50.71,6.31 arc(50.98,6.13) 51.29,6.07 51.99,6.07 arc(52.33,6.14) 52.62,6.33
  vias: v1(8.98,47.64) v1(8.98,46.78) v1(8.93,22.25) v1(8.93,21.38) v1(9.04,73.03) v1(9.04,72.17) v1(9.68,21.82) v1(9.79,72.6) v1(9.73,47.21) v1(10.1,8.3) v1(10.2,59.08) v1(10.15,33.69) v1(10.91,26.01) v1(11.01,76.8) v1(10.96,51.41) v1(11.39,52.16) v1(11.34,26.76) v1(11.45,77.55) v1(11.82,51.41) v1(11.77,26.01) v1(11.88,76.8) v1(12.99,52.97) v1(12.94,27.57) v1(13.05,78.36) v1(13.42,52.22) v1(13.37,26.82) v1(13.48,77.61) v1(13.8,27.57) v1(13.91,78.36) v1(13.86,52.97) v1(15.02,51.41) v1(14.97,26.01) v1(15.08,76.8) v1(15.4,26.76) v1(15.51,77.55) v1(15.45,52.16) v1(15.89,51.41) v1(15.84,26.01) v1(15.94,76.8) v1(48.99,77.08) v1(48.99,76.47) v1(49.01,67.06) v1(49.01,66.45) v1(49,57.05) v1(49,56.43) v1(49.01,47.03) v1(49.01,46.41) v1(49.09,37.01) v1(49.09,36.39) v1(49.1,26.99) v1(49.1,26.37) v1(49.1,16.97) v1(49.1,16.36) v1(49.11,6.95) v1(49.11,6.34) v1(51.16,82.49) v1(51.17,72.47) v1(51.17,62.45) v1(51.18,52.43) v1(51.26,42.41) v1(51.27,32.39) v1(51.27,22.37) v1(51.28,12.35) v2(25.85,76.94) v2(25.85,76.04) v2(25.9,49.94) v2(25.9,49.04) v2(25.95,22.95) v2(25.95,22.05) v2(33.97,65.47) v2(33.97,64.49) v2(34.02,38.47) v2(34.02,37.49) v2(34.07,11.48) v2(34.07,10.49)
